# EAGLE design mk312lite_V4a (EAGLE 9.6.2)

## Sheet 1 of 5: PSU
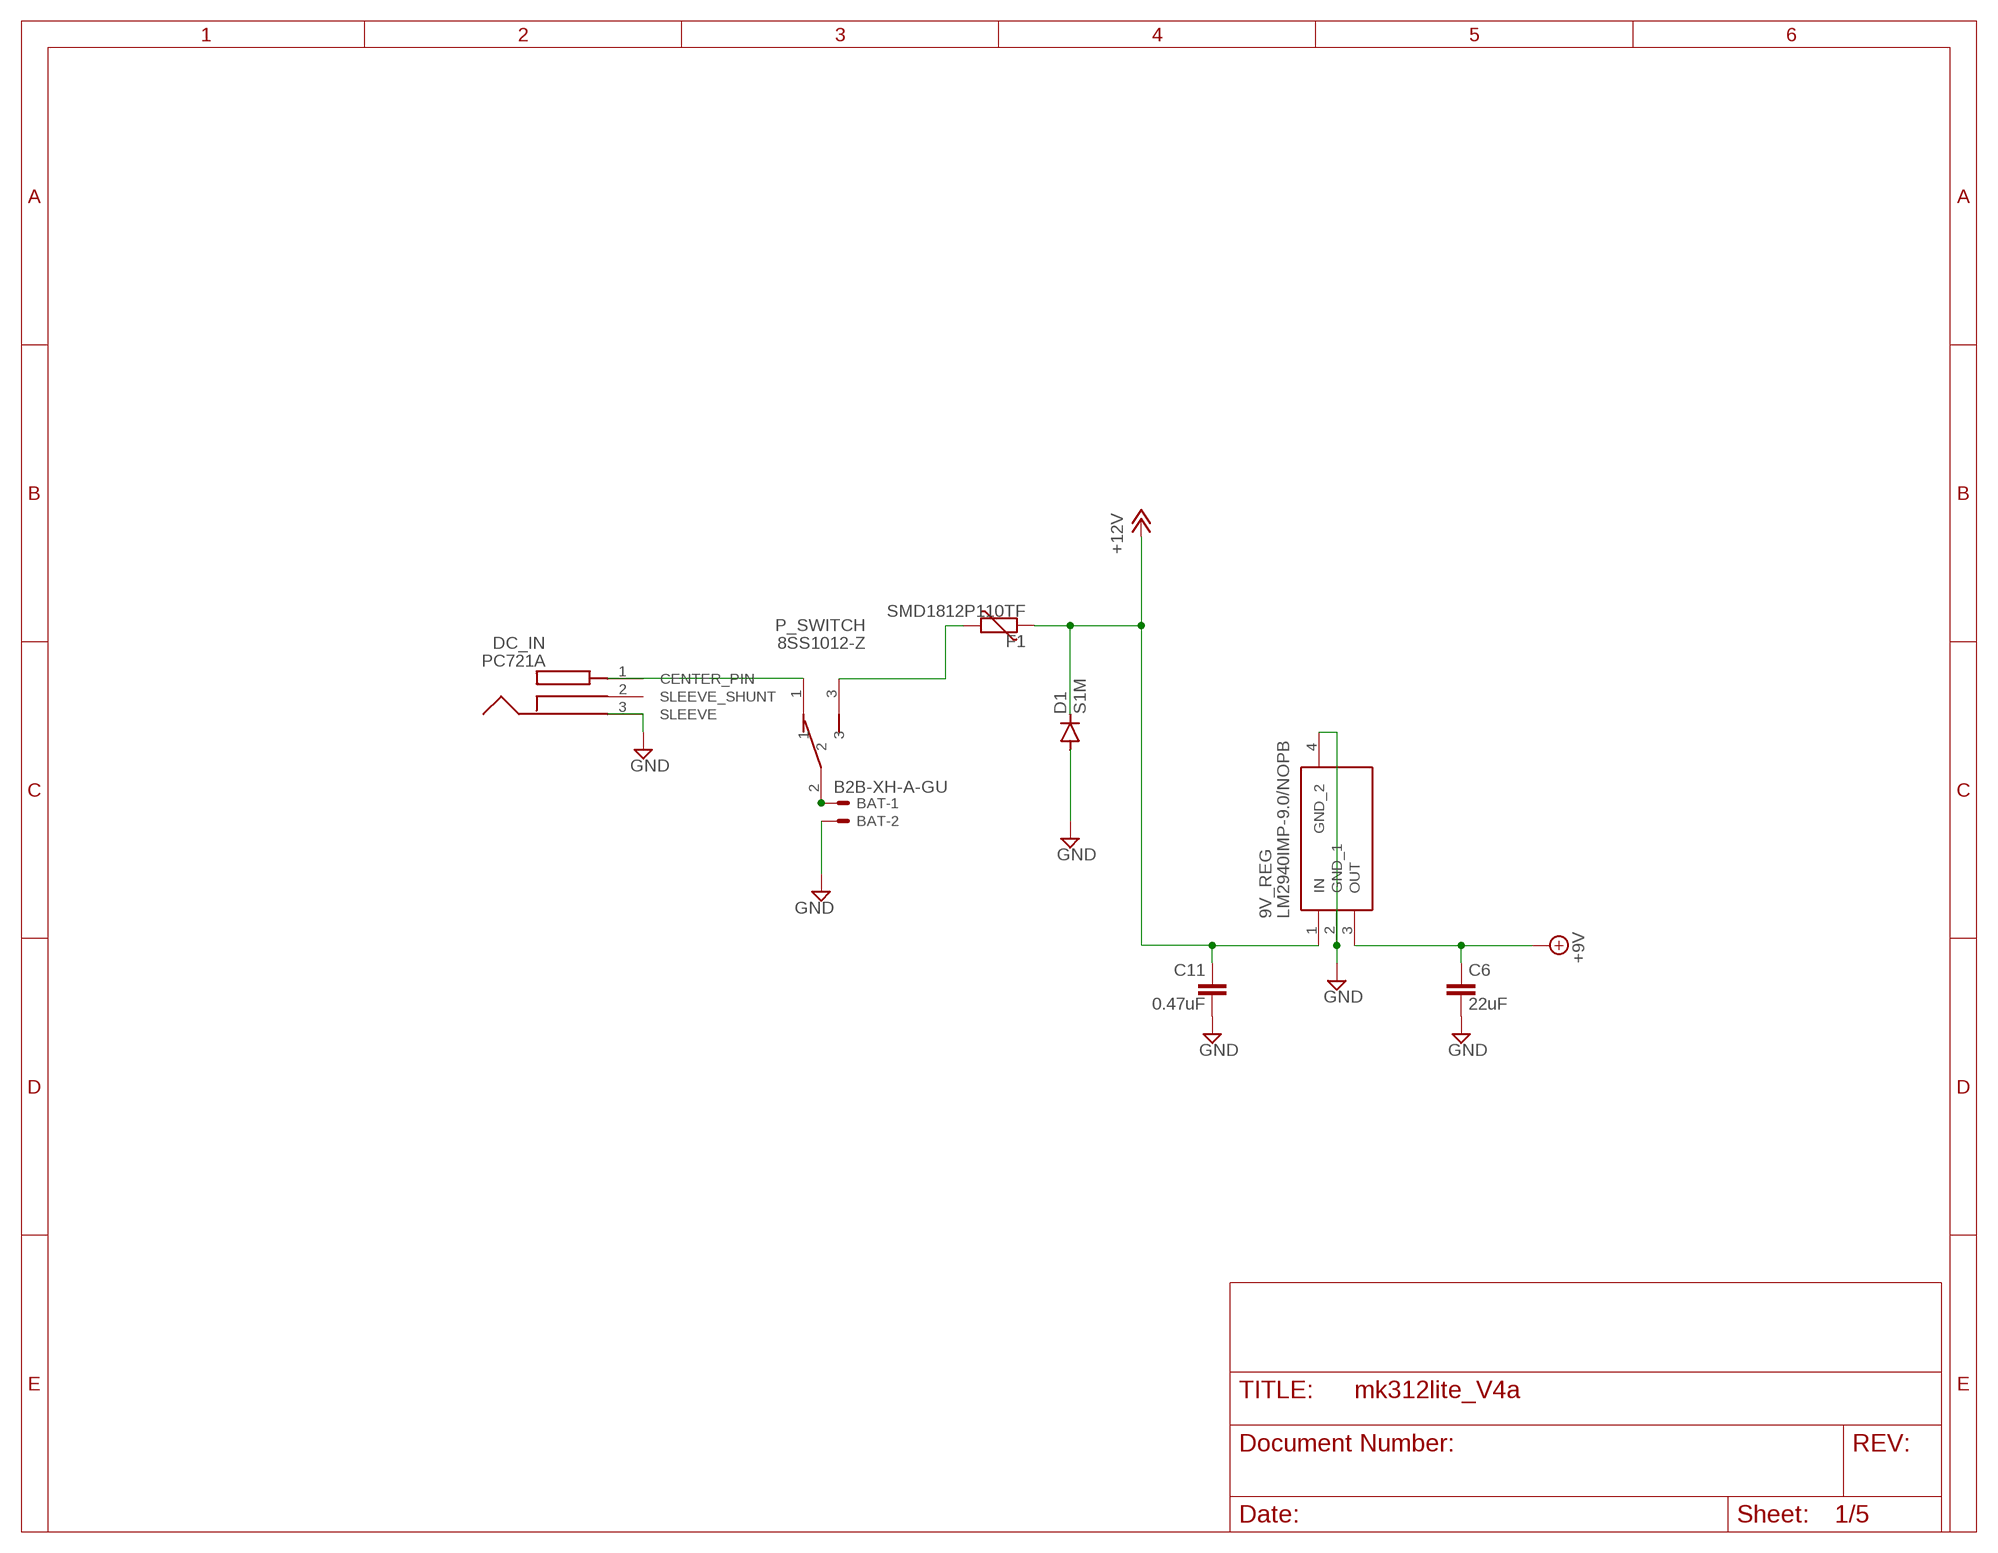
[diagram p0: schematic, sheet 1]

### Parts
9V_REG  LM2940IMP-9.0/NOPB  LM2940IMP-9.0_NOPB  [SOT230P700X180-4N]
BAT  B2B-XH-A-GU  JST-XH-02-PIN-LONG-PAD  [JST-XH-02-PACKAGE-LONG-PAD]
C6  22uF  C-EUC1206  [C1206]
C11  0.47uF  C-EUC0805  [C0805]
D1  S1M  [SMA]
DC_IN  PC721A  [PC721A]
F1  SMD1812P110TF  VARISTORCN1812  [CT/CN1812]
P_SWITCH  8SS1012-Z  [8SS1012Z]

### Nets
+9V [pwr]: 9V_REG.3(OUT) C6.1 ; also sheet 4
+12V [pwr]: 9V_REG.1(IN) C11.1 D1.C F1.2 ; also sheet 2,5
GND [pwr]: 9V_REG.2(GND_1) 9V_REG.4(GND_2) BAT.2 C6.2 C11.2 D1.A DC_IN.3(SLEEVE) ; also sheet 2,3,4,5
N$9: BAT.1 P_SWITCH.2
N$10: F1.1 P_SWITCH.3
N$14: DC_IN.1(CENTER_PIN) P_SWITCH.1
Unconnected: DC_IN.2(SLEEVE_SHUNT)

## Sheet 2 of 5
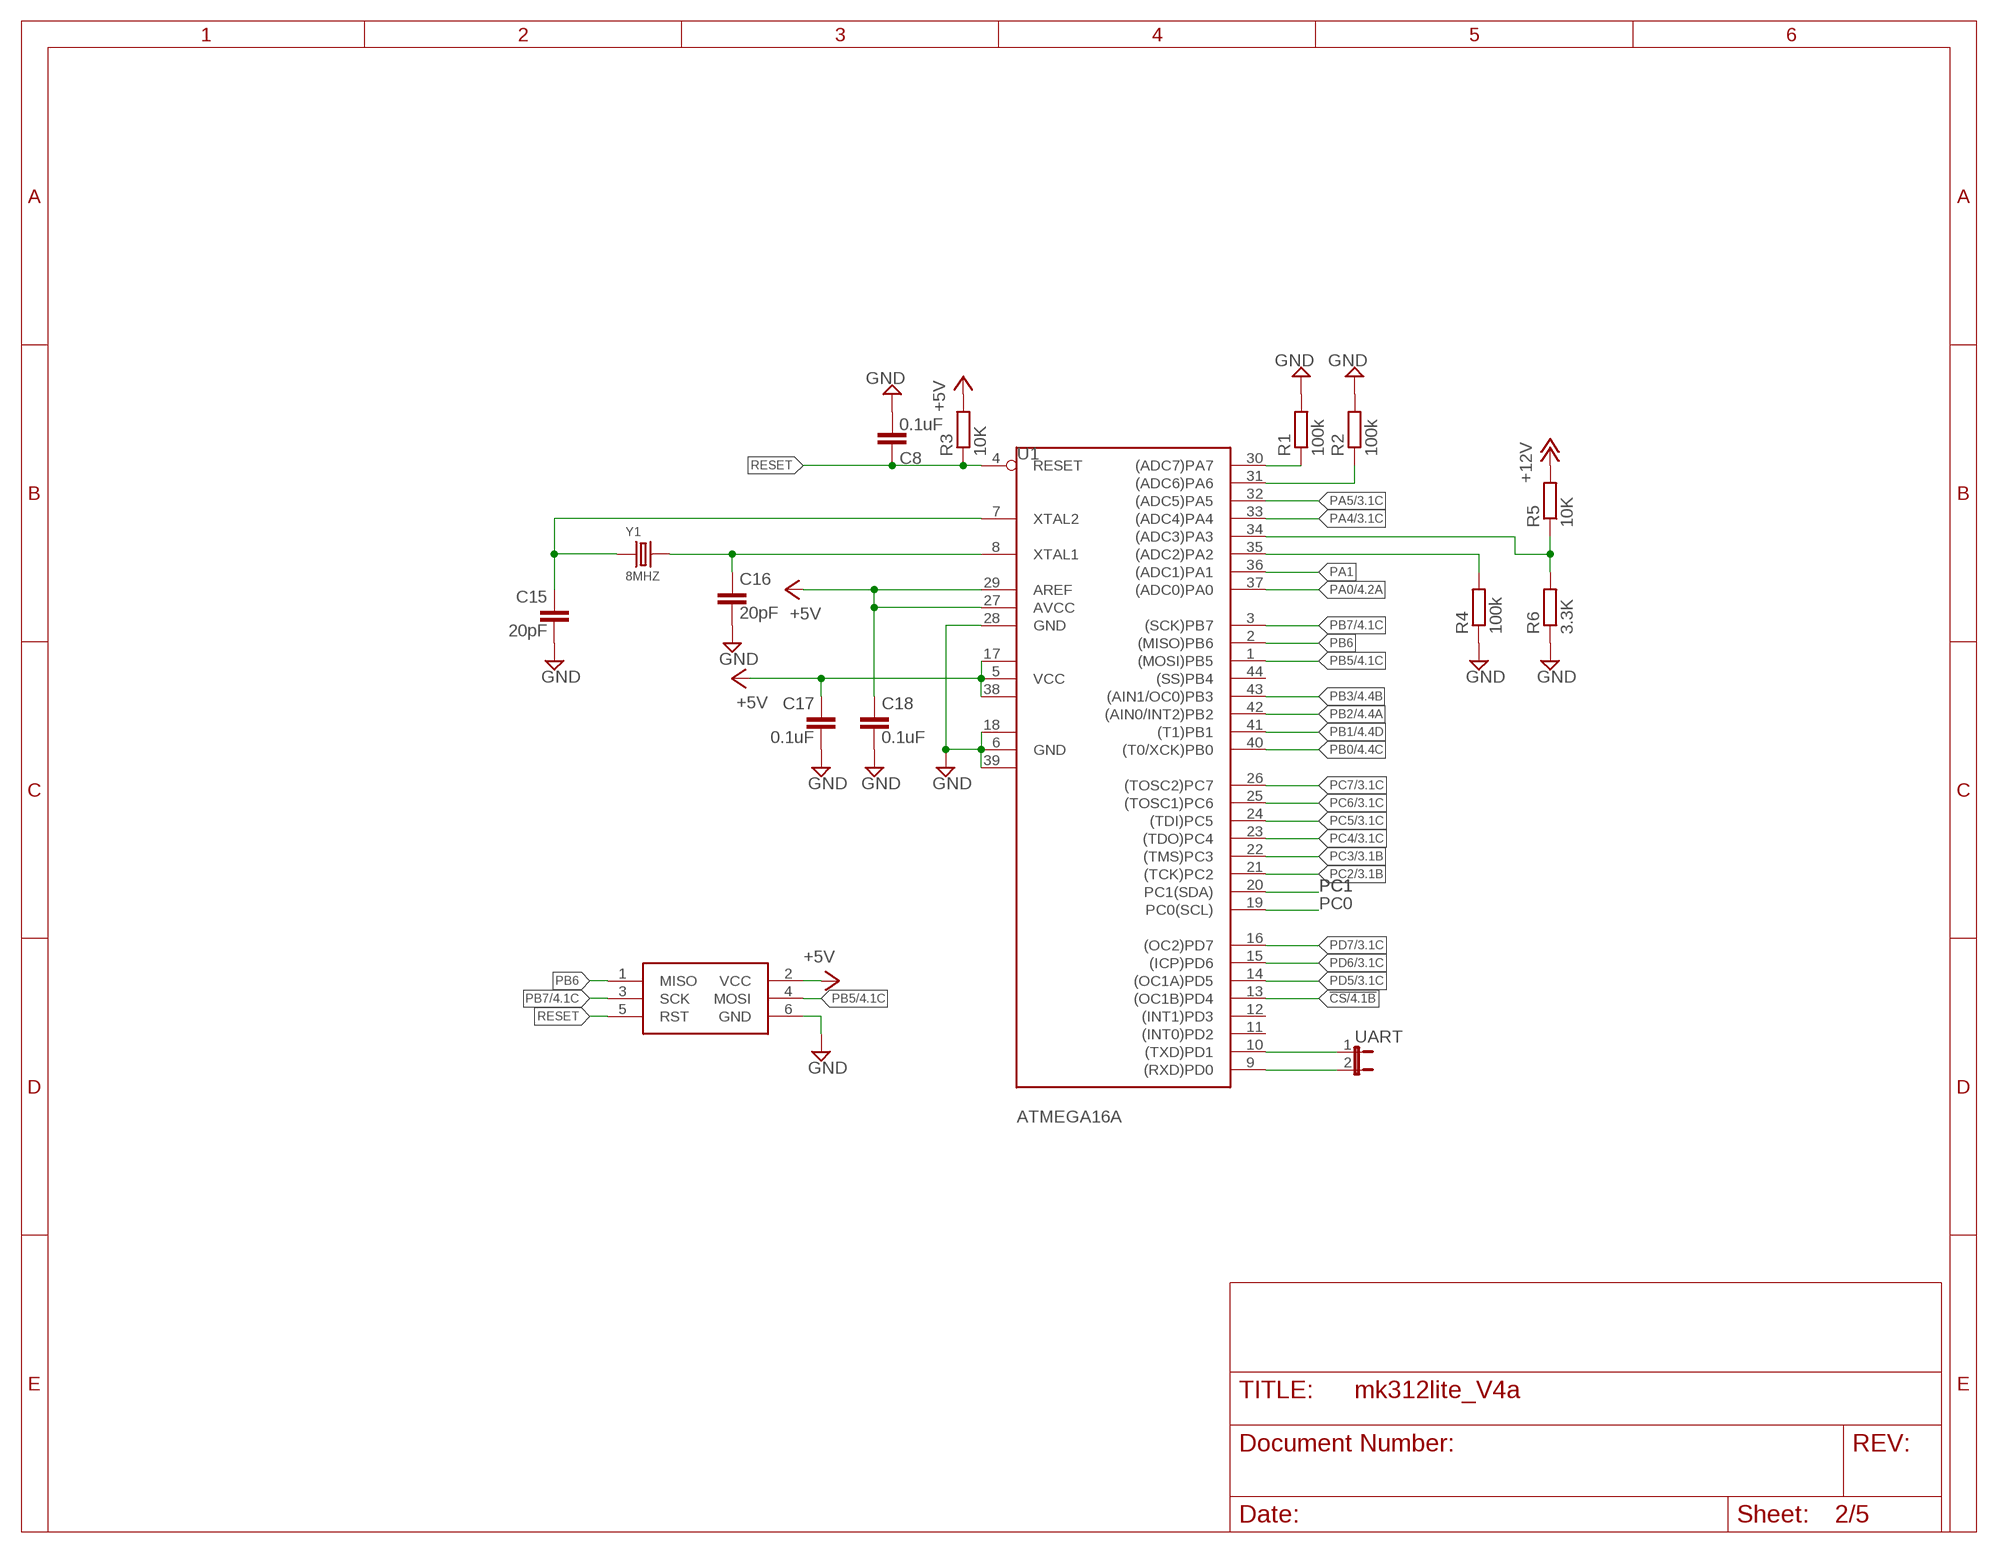
[diagram p1: schematic, sheet 2]

### Parts
C8  0.1uF  C-EUC0805  [C0805]
C15  20pF  C-EUC0603  [C0603]
C16  20pF  C-EUC0603  [C0603]
C17  0.1uF  C-EUC0805  [C0805]
C18  0.1uF  C-EUC0805  [C0805]
ISP1  AVRISP-6  [AVRISP]
R1  100k  R-EU_R0805  [R0805]
R2  100k  R-EU_R0805  [R0805]
R3  10K  R-EU_R0805  [R0805]
R4  100k  R-EU_R0805  [R0805]
R5  10K  R-EU_R0805  [R0805]
R6  3.3K  R-EU_R0805  [R0805]
U1  ATMEGA16A  MEGA16-A  [TQFP44]
UART  JP1E  [JP1]
Y1  8MHZ  SMD-CRYSTAL-8MHZ-20PF-20PPM(2P-5.0X3.2MM)  [X2-SMD-5.0X3.2X1.3MM]

### Nets
!CS: U1.13((OC1B)PD4) ; also sheet 4
+5V [pwr]: C17.1 C18.1 ISP1.2(VCC) R3.2 U1.5(VCC) U1.17(VCC1) U1.27(AVCC) U1.29(AREF) U1.38(VCC2) ; also sheet 3,4,5
+12V [pwr]: R5.2 ; also sheet 1,5
GND [pwr]: C8.2 C15.2 C16.2 C17.2 C18.2 ISP1.6(GND) R1.2 R2.2 R4.1 R6.1 U1.6(GND) U1.18(GND1) U1.28(GND) U1.39(GND2) ; also sheet 1,3,4,5
N$2: R5.1 R6.2 U1.34((ADC3)PA3)
N$3: R4.2 U1.35((ADC2)PA2)
N$16: R1.1 U1.30((ADC7)PA7)
N$17: C16.1 U1.8(XTAL1) Y1.2
N$20: R2.1 U1.31((ADC6)PA6)
N$26: U1.10((TXD)PD1) UART.1
N$31: U1.9((RXD)PD0) UART.2
N$32: C15.1 U1.7(XTAL2) Y1.1
PA0: U1.37((ADC0)PA0) ; also sheet 4
PA1: U1.36((ADC1)PA1) ; also sheet 3
PA4: U1.33((ADC4)PA4) ; also sheet 3
PA5: U1.32((ADC5)PA5) ; also sheet 3
PB0: U1.40((T0/XCK)PB0) ; also sheet 4
PB1: U1.41((T1)PB1) ; also sheet 4
PB2: U1.42((AIN0/INT2)PB2) ; also sheet 4
PB3: U1.43((AIN1/OC0)PB3) ; also sheet 4
PB5: ISP1.4(MOSI) U1.1((MOSI)PB5) ; also sheet 4
PB6: ISP1.1(MISO) U1.2((MISO)PB6)
PB7: ISP1.3(SCK) U1.3((SCK)PB7) ; also sheet 4
PC0: U1.19(PC0(SCL)) ; also sheet 3
PC1: U1.20(PC1(SDA)) ; also sheet 3
PC2: U1.21((TCK)PC2) ; also sheet 3
PC3: U1.22((TMS)PC3) ; also sheet 3
PC4: U1.23((TDO)PC4) ; also sheet 3
PC5: U1.24((TDI)PC5) ; also sheet 3
PC6: U1.25((TOSC1)PC6) ; also sheet 3
PC7: U1.26((TOSC2)PC7) ; also sheet 3
PD5: U1.14((OC1A)PD5) ; also sheet 3
PD6: U1.15((ICP)PD6) ; also sheet 3
PD7: U1.16((OC2)PD7) ; also sheet 3
RESET: C8.1 ISP1.5(RST) R3.1 U1.4(RESET)
Unconnected: U1.11((INT0)PD2) U1.12((INT1)PD3) U1.44((SS)PB4)

## Sheet 3 of 5: Small PCB
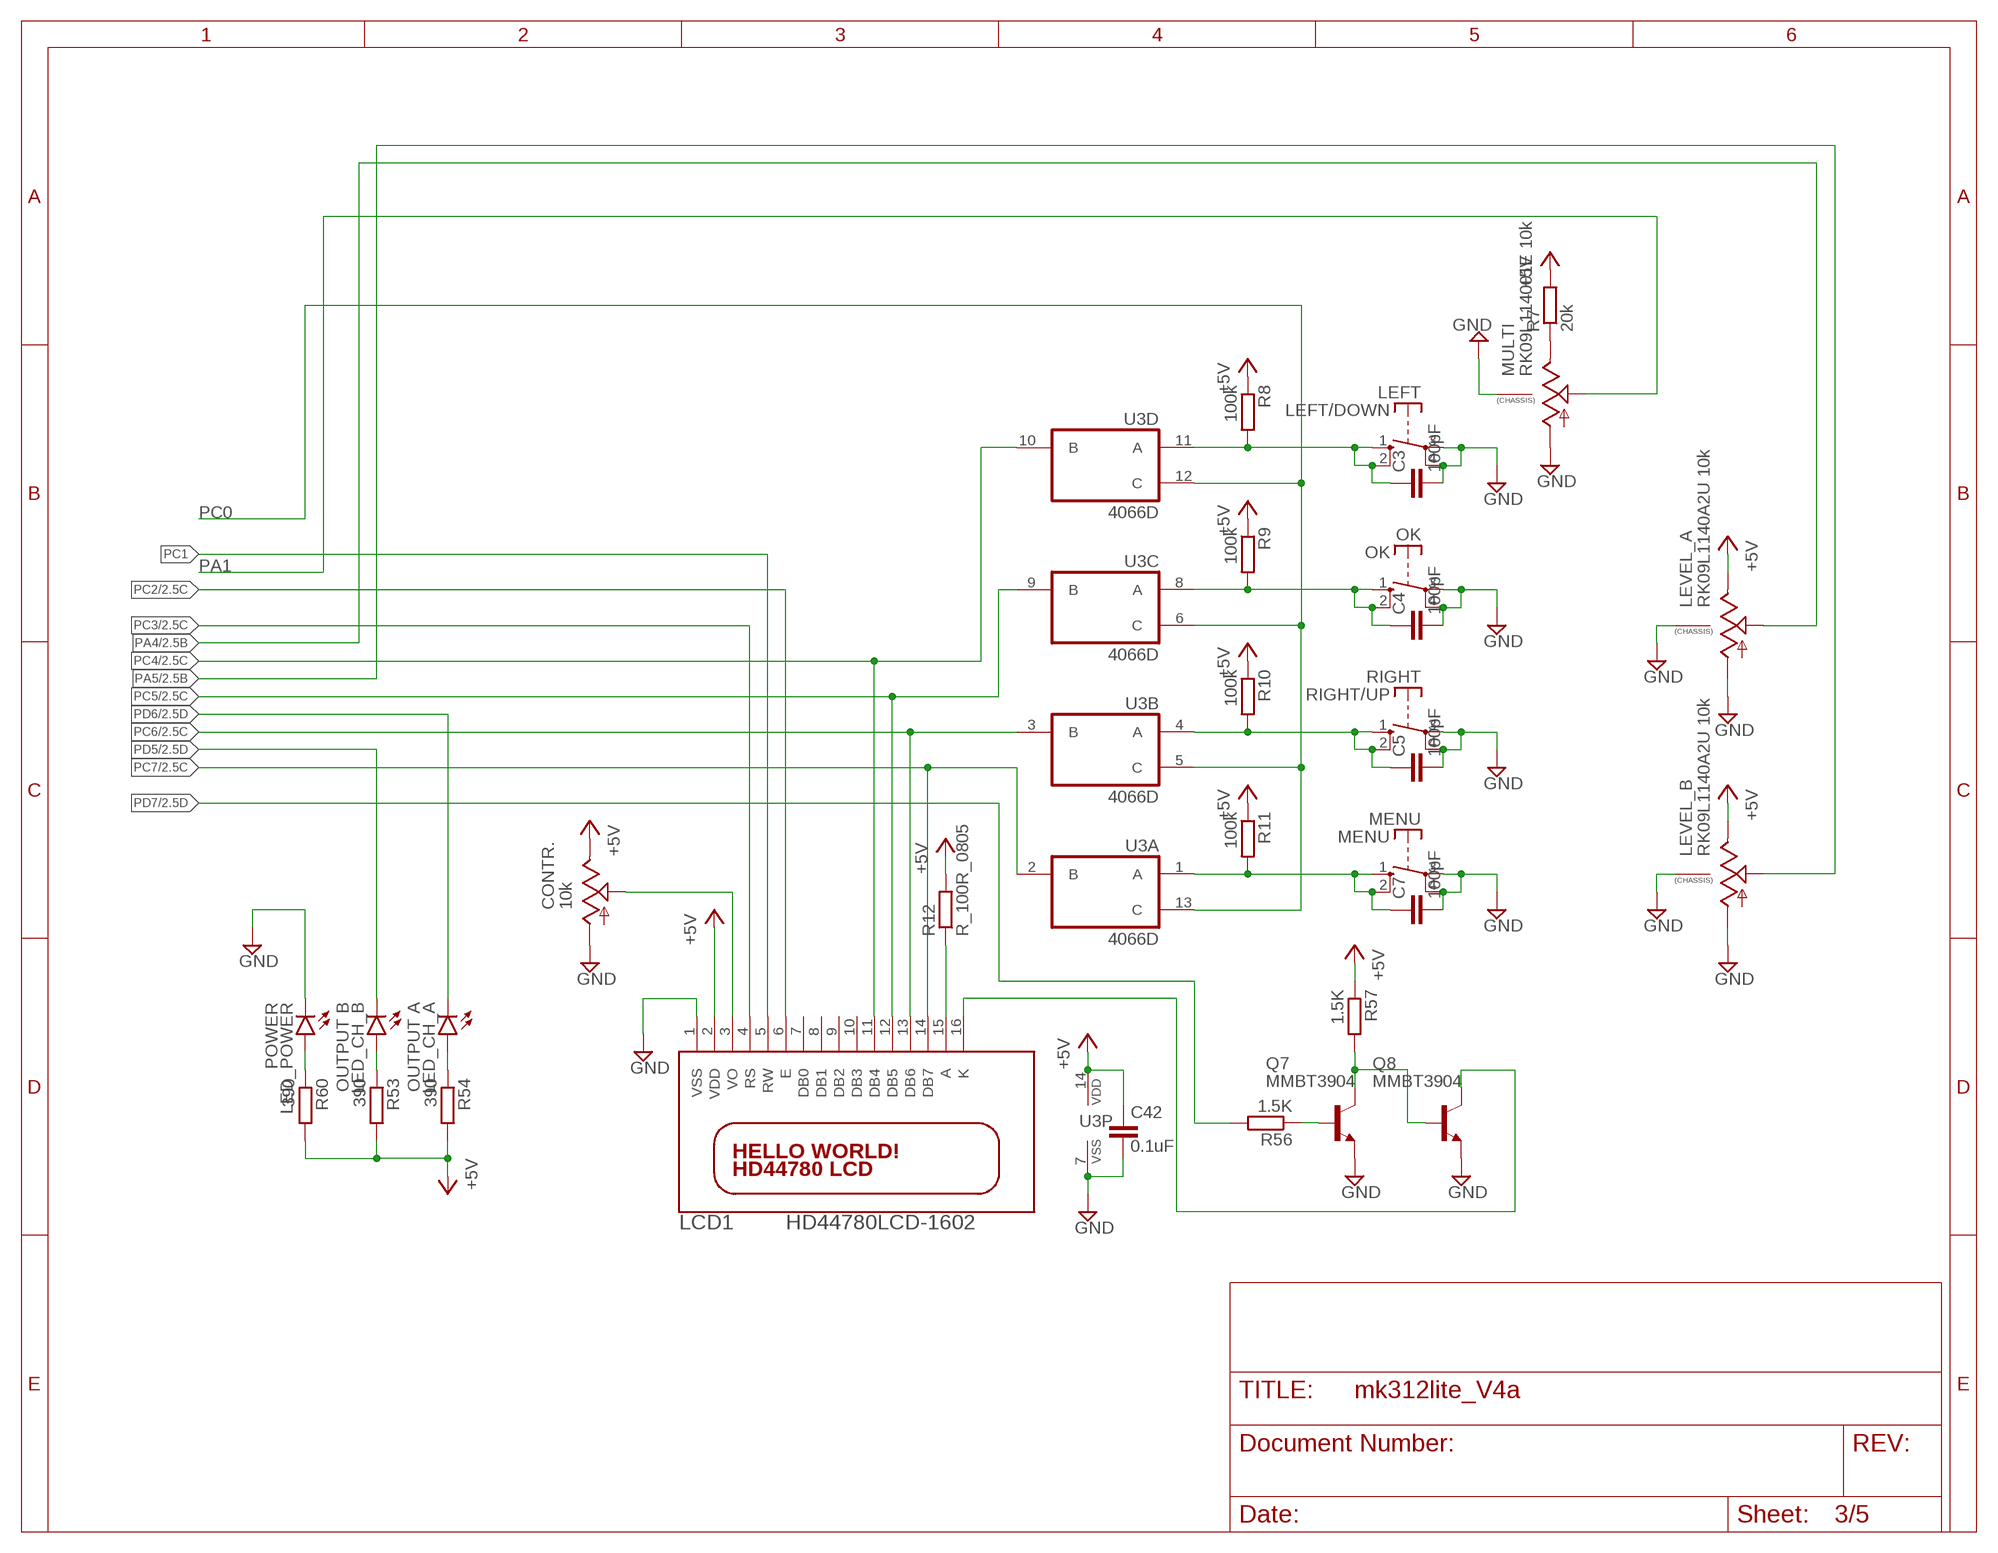
[diagram p2: schematic, sheet 3]

### Parts
C3  100pF  C-EUC0805  [C0805]
C4  100pF  C-EUC0805  [C0805]
C5  100pF  C-EUC0805  [C0805]
C7  100pF  C-EUC0805  [C0805]
C42  0.1uF  C-EUC0805  [C0805]
CONTR.  10k  TRIM_US-B25P  [B25P]
LCD1  HD44780LCD-1602  [LCD1602]
LED_CH_A  OUTPUT A  LED3MM  [LED3MM]
LED_CH_B  OUTPUT B  LED3MM  [LED3MM]
LED_POWER  POWER  LED3MM  [LED3MM]
LEFT  LEFT/DOWN  DTE6K  [DTE6K]
LEVEL_A  RK09L1140A2U 10k  9MM_SNAP-IN_POT_CHASSIS  [9MM_SNAP-IN_POT]
LEVEL_B  RK09L1140A2U 10k  9MM_SNAP-IN_POT_CHASSIS  [9MM_SNAP-IN_POT]
MENU  MENU  DTE6K  [DTE6K]
MULTI  RK09L114001E 10k  9MM_SNAP-IN_POT_CHASSIS  [9MM_SNAP-IN_POT]
OK  OK  DTE6K  [DTE6K]
Q7  MMBT3904  MMBT3904LT1-NPN-SOT23-BEC  [SOT23-BEC]
Q8  MMBT3904  MMBT3904LT1-NPN-SOT23-BEC  [SOT23-BEC]
R7  20k  R-EU_R0805  [R0805]
R8  100k  R-EU_R0805  [R0805]
R9  100k  R-EU_R0805  [R0805]
R10  100k  R-EU_R0805  [R0805]
R11  100k  R-EU_R0805  [R0805]
R12  R_100R_0805  [R0805]
R53  390  R-EU_R0805  [R0805]
R54  390  R-EU_R0805  [R0805]
R56  1.5K  R-EU_R0805  [R0805]
R57  1.5K  R-EU_R0805  [R0805]
R60  390  R-EU_R0805  [R0805]
RIGHT  RIGHT/UP  DTE6K  [DTE6K]
U3  4066D  [SO14]

### Nets
+5V [pwr]: C42.1 CONTR..E LCD1.2(VDD) LEVEL_A.3(E) LEVEL_B.3(E) R7.2 R8.1 R9.1 R10.1 R11.1 R12.2 R53.2 R54.2 R57.1 R60.2 U3.14(P:VDD) ; also sheet 2,4,5
GND [pwr]: C3.2 C4.2 C5.2 C7.2 C42.2 CONTR..A LCD1.1(VSS) LED_POWER.K(C) LEFT.3(P) LEFT.4(P) LEVEL_A.1(A) LEVEL_A.CHASSIS2 LEVEL_B.1(A) LEVEL_B.CHASSIS2 MENU.3(P) MENU.4(P) MULTI.1(A) MULTI.CHASSIS2 OK.3(P) OK.4(P) Q7.E Q8.E RIGHT.3(P) RIGHT.4(P) U3.7(P:VSS) ; also sheet 1,2,4,5
N$1: MULTI.3(E) R7.1
N$4: C4.1 OK.1(S) OK.2(S) R9.2 U3.8(C:A)
N$5: C3.1 LEFT.1(S) LEFT.2(S) R8.2 U3.11(D:A)
N$7: C5.1 R10.2 RIGHT.1(S) RIGHT.2(S) U3.4(B:A)
N$23: LED_CH_B.A R53.1
N$29: LED_CH_A.A R54.1
N$30: CONTR..S LCD1.3(VO)
N$47: LCD1.15(A) R12.1
N$80: C7.1 MENU.1(S) MENU.2(S) R11.2 U3.1(A:A)
N$81: LED_POWER.A R60.1
N$82: Q7.B R56.1
N$83: Q7.C Q8.B R57.2
N$84: LCD1.16(K) Q8.C
PA1: MULTI.2(S) ; also sheet 2
PA4: LEVEL_A.2(S) ; also sheet 2
PA5: LEVEL_B.2(S) ; also sheet 2
PC0: U3.5(B:C) U3.6(C:C) U3.12(D:C) U3.13(A:C) ; also sheet 2
PC1: LCD1.5(RW) ; also sheet 2
PC2: LCD1.6(E) ; also sheet 2
PC3: LCD1.4(RS) ; also sheet 2
PC4: LCD1.11(DB4) U3.10(D:B) ; also sheet 2
PC5: LCD1.12(DB5) U3.9(C:B) ; also sheet 2
PC6: LCD1.13(DB6) U3.3(B:B) ; also sheet 2
PC7: LCD1.14(DB7) U3.2(A:B) ; also sheet 2
PD5: LED_CH_B.K(C) ; also sheet 2
PD6: LED_CH_A.K(C) ; also sheet 2
PD7: R56.2 ; also sheet 2
Unconnected: LCD1.7(DB0) LCD1.8(DB1) LCD1.9(DB2) LCD1.10(DB3)

## Sheet 4 of 5: Output stage
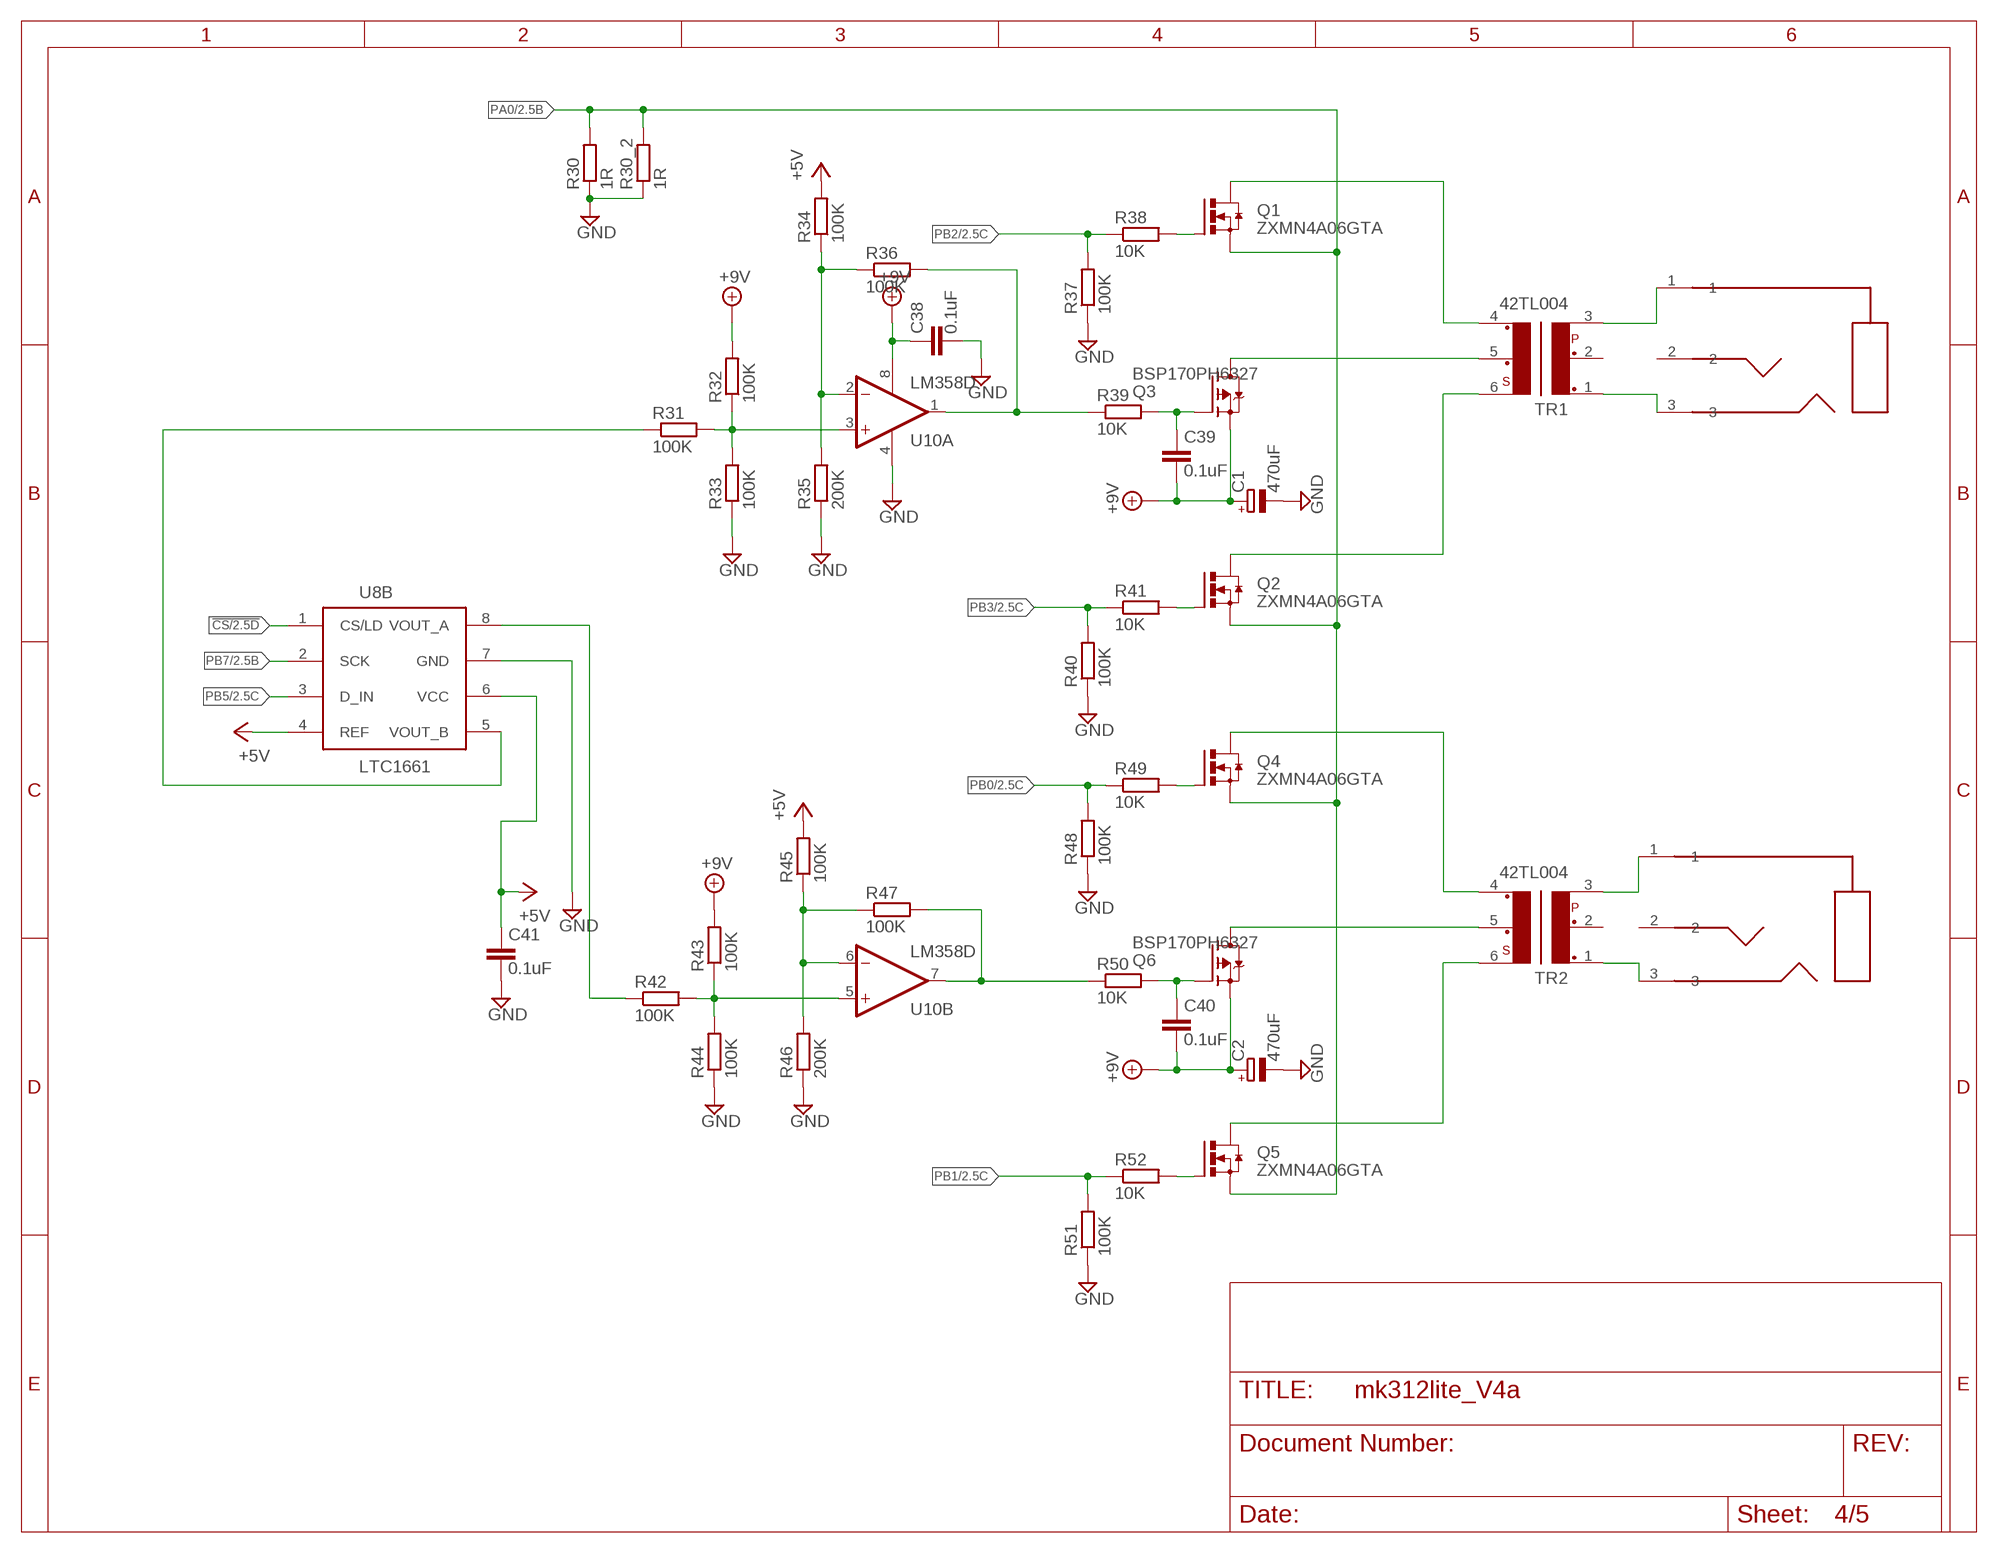
[diagram p3: schematic, sheet 4]

### Parts
C1  470uF  CPOL-EU150CLZ-1010  [150CLZ-1010]
C2  470uF  CPOL-EU150CLZ-1010  [150CLZ-1010]
C38  0.1uF  C-EUC0805  [C0805]
C39  0.1uF  C-EUC0805  [C0805]
C40  0.1uF  C-EUC0805  [C0805]
C41  0.1uF  C-EUC0805  [C0805]
CHAN_A  PJ-301C  PC-301C  [PJ-301C]
CHAN_B  PJ-301C  PC-301C  [PJ-301C]
Q1  ZXMN4A06GTA  N-HEXFET-2D_SOT232-IRLL2705  [SOT223]
Q2  ZXMN4A06GTA  N-HEXFET-2D_SOT232-IRLL2705  [SOT223]
Q3  BSP170PH6327  IRFL9014TRPBF  [SOT230P700X180-4N]
Q4  ZXMN4A06GTA  N-HEXFET-2D_SOT232-IRLL2705  [SOT223]
Q5  ZXMN4A06GTA  N-HEXFET-2D_SOT232-IRLL2705  [SOT223]
Q6  BSP170PH6327  IRFL9014TRPBF  [SOT230P700X180-4N]
R30  1R  R-EU_R1206  [R1206]
R30_2  1R  R-EU_R1206  [R1206]
R31  100K  R-EU_R0805  [R0805]
R32  100K  R-EU_R0805  [R0805]
R33  100K  R-EU_R0805  [R0805]
R34  100K  R-EU_R0805  [R0805]
R35  200K  R-EU_R0805  [R0805]
R36  100K  R-EU_R0805  [R0805]
R37  100K  R-EU_R0805  [R0805]
R38  10K  R-EU_R0805  [R0805]
R39  10K  R-EU_R0805  [R0805]
R40  100K  R-EU_R0805  [R0805]
R41  10K  R-EU_R0805  [R0805]
R42  100K  R-EU_R0805  [R0805]
R43  100K  R-EU_R0805  [R0805]
R44  100K  R-EU_R0805  [R0805]
R45  100K  R-EU_R0805  [R0805]
R46  200K  R-EU_R0805  [R0805]
R47  100K  R-EU_R0805  [R0805]
R48  100K  R-EU_R0805  [R0805]
R49  10K  R-EU_R0805  [R0805]
R50  10K  R-EU_R0805  [R0805]
R51  100K  R-EU_R0805  [R0805]
R52  10K  R-EU_R0805  [R0805]
TR1  42TL004  42TL023  [42TL]
TR2  42TL004  42TL023  [42TL]
U8B  LTC1661  LTC1661IMS8  [MSOP8]
U10  LM358D  [SO08]

### Nets
!CS: U8B.1(CS/LD) ; also sheet 2
+5V [pwr]: C41.1 R34.2 R45.2 U8B.4(REF) U8B.6(VCC) ; also sheet 2,3,5
+9V [pwr]: C1.+ C2.+ C38.1 C39.2 C40.2 Q3.3(S) Q6.3(S) R32.2 R43.2 U10.8(P:V+) ; also sheet 1
GND [pwr]: C1.- C2.- C38.2 C41.2 R30.1 R30_2.1 R33.1 R35.1 R37.1 R40.1 R44.1 R46.1 R48.1 R51.1 U8B.7(GND) U10.4(P:V-) ; also sheet 1,2,3,5
N$6: Q3.2(D) Q3.4(D) TR1.5
N$8: Q6.2(D) Q6.4(D) TR2.5
N$11: CHAN_A.1 TR1.3
N$12: CHAN_A.3 TR1.1
N$13: CHAN_B.1 TR2.3
N$15: CHAN_B.3 TR2.1
N$18: Q1.1(G) R38.2
N$19: Q2.1(G) R41.2
N$21: C39.1 Q3.1(G) R39.2
N$22: R31.2 R32.1 R33.2 U10.3(A:+IN)
N$24: Q4.1(G) R49.2
N$25: Q5.1(G) R52.2
N$27: C40.1 Q6.1(G) R50.2
N$28: R42.2 R43.1 R44.2 U10.5(B:+IN)
N$34: Q1.2(D) Q1.4(D) TR1.4
N$36: Q4.2(D) Q4.4(D) TR2.4
N$38: Q5.2(D) Q5.4(D) TR2.6
N$39: Q2.2(D) Q2.4(D) TR1.6
N$40: R34.1 R35.2 R36.1 U10.2(A:-IN)
N$41: R45.1 R46.2 R47.1 U10.6(B:-IN)
N$42: R31.1 U8B.5(VOUT_B)
N$85: R42.1 U8B.8(VOUT_A)
PA0: Q1.3(S) Q2.3(S) Q4.3(S) Q5.3(S) R30.2 R30_2.2 ; also sheet 2
PB0: R48.2 R49.1 ; also sheet 2
PB1: R51.2 R52.1 ; also sheet 2
PB2: R37.2 R38.1 ; also sheet 2
PB3: R40.2 R41.1 ; also sheet 2
PB5: U8B.3(D_IN) ; also sheet 2
PB7: U8B.2(SCK) ; also sheet 2
PFET_A: R36.2 R39.1 U10.1(A:OUT)
PFET_B: R47.2 R50.1 U10.7(B:OUT)
Unconnected: CHAN_A.2 CHAN_B.2 TR1.2 TR2.2

## Sheet 5 of 5
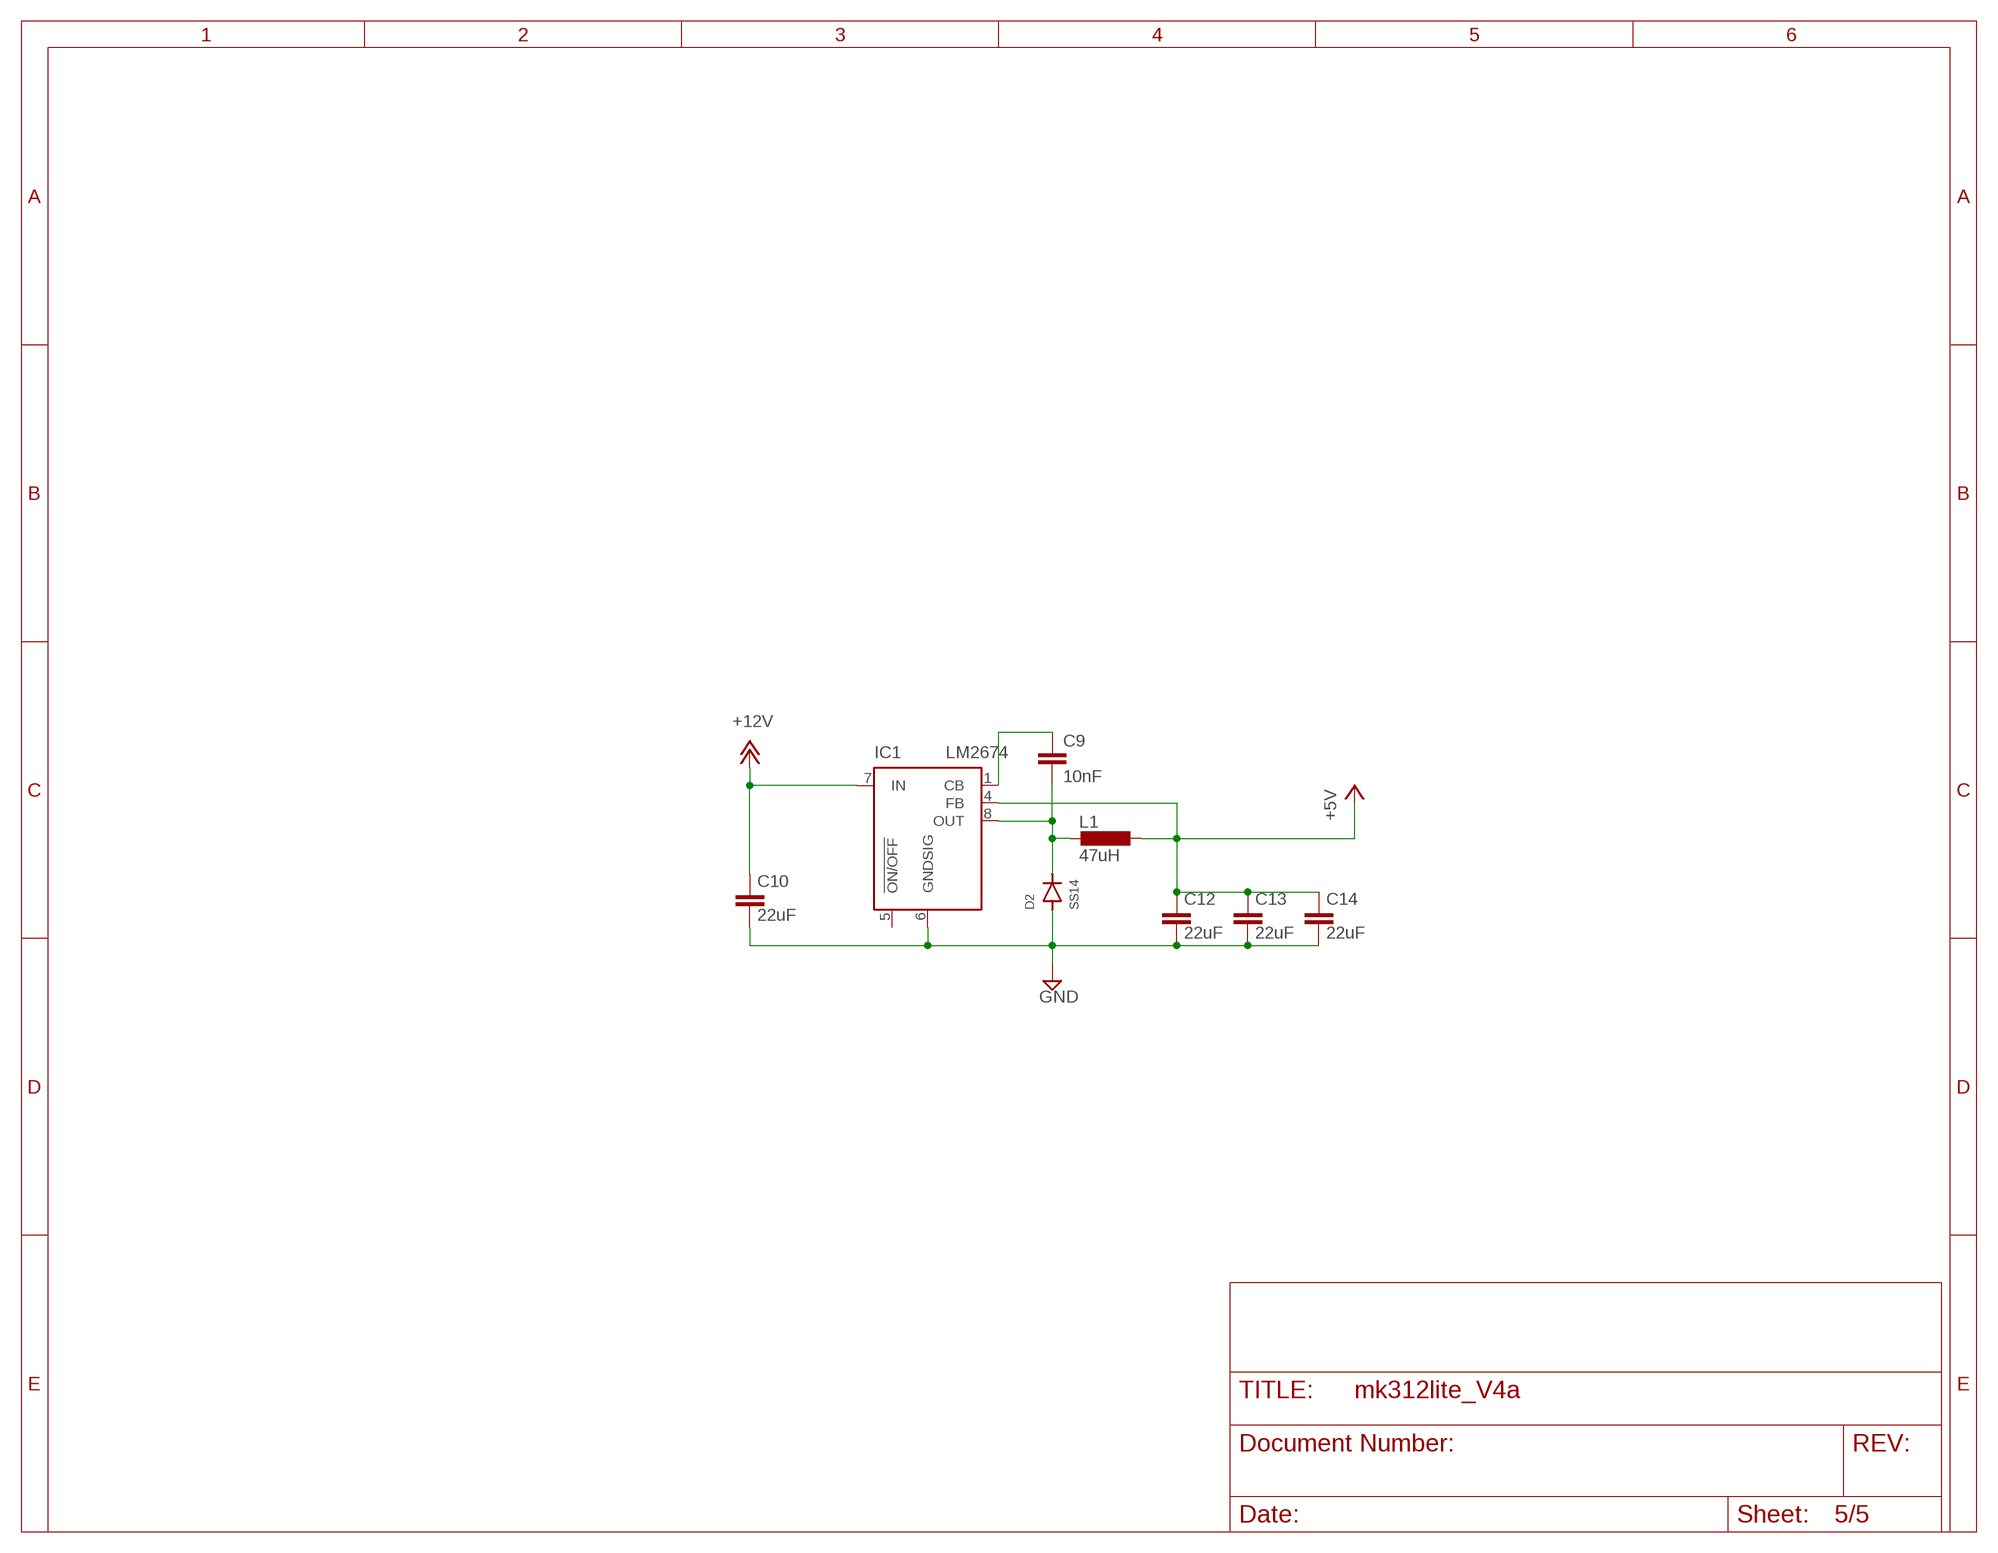
[diagram p4: schematic, sheet 5]

### Parts
C9  10nF  C-EUC0805  [C0805]
C10  22uF  C-EUC1206  [C1206]
C12  22uF  C-EUC1206  [C1206]
C13  22uF  C-EUC1206  [C1206]
C14  22uF  C-EUC1206  [C1206]
D2  SS14  S1M  [SMA]
IC1  LM2674  [SO08]
L1  47uH  SMNR4030-151MT  [SMNR4030-151MT]

### Nets
+5V [pwr]: C12.1 C13.1 C14.1 IC1.4(FB) L1.2 ; also sheet 2,3,4
+12V [pwr]: C10.1 IC1.7(IN) ; also sheet 1,2
GND [pwr]: C10.2 C12.2 C13.2 C14.2 D2.A IC1.6(GNDSIG) ; also sheet 1,2,3,4
N$33: C9.1 IC1.1(CB)
N$35: C9.2 D2.C IC1.8(OUT) L1.1
Unconnected: IC1.5(!ON/OFF)

## Library data of the parts
9V_REG = SamacSys_Parts:LM2940IMP-9.0_NOPB: LDO Voltage Regulators 1A LDO Reg Source: Datasheet <https://www.ti.com/lit/gpn/LM2940-N>; DESCRIPTION: LDO Voltage Regulators 1A LDO Reg; HEIGHT: 1.8mm; MANUFACTURER_NAME: Texas Instruments; MANUFACTURER_PART_NUMBER: LM2940IMP-9.0/NOPB; MOUSER_PART_NUMBER: 926-LM2940IMP90NOPB; MOUSER_PRICE-STOCK: https://www.mouser.co.uk/ProductDetail/Texas-Instruments/LM2940IMP-90-NOPB?qs=X1J7HmVL2ZFSe6ClMcvP2A%3D%3D
BAT = Rembrandt Electronics - JST XH Connectors v1-0:JST-XH-02-PIN: JST XH Connector 2 Pin Wire to board connector. Pitch: 2,54 mm, (0.100") Number of pins: 2 Created by Rembrandt Electronics www.rembrandtelectronics.com
C1 C2 = rcl:CPOL-EU: POLARIZED CAPACITOR, European symbol; SPICEPREFIX: C
C3-C18 C38-C42 = rcl:C-EU: CAPACITOR, European symbol; SPICEPREFIX: C
CHAN_A CHAN_B = MK312parts:PC-301C
CONTR. = pot:TRIM_US-: POTENTIOMETER
D1 D2 = diode:S1M
DC_IN = SamacSys_Parts:PC721A: Conn DC Power RCP 2 POS Solder ST Thru-Hole 3 Terminal 1 Port Source: Datasheet; DESCRIPTION: Conn DC Power RCP 2 POS Solder ST Thru-Hole 3 Terminal 1 Port; HEIGHT: 13.7mm; MANUFACTURER_NAME: Switchcraft; MANUFACTURER_PART_NUMBER: PC721A; MOUSER_PART_NUMBER: 502-PC721A; MOUSER_PRICE-STOCK: https://www.mouser.co.uk/ProductDetail/Switchcraft/PC721A?qs=fAHHVMwC%252BbgD1XRuKMSqcA%3D%3D
F1 = varistor:VARISTOR: VARISTOR
IC1 = Eagle-JeeLabs:LM2674: 0.5A Step-Down Voltage Regulator
ISP1 = adafruit:AVRISP: AVR ISP HEADER Standard 6 pin header for AVR programming
L1 = MK312parts:SMNR4030-151MT: Shielded Power Inductors Package 6.6 × 6.6 mm x 4.1 mm high Source: http://www.farnell.com/datasheets/1681958.pdf
LCD1 = MK312parts:HD44780LCD: HD44780 LCD Standard character type LCDs, available in sizes from 8x1 to 40x4!
LED_CH_A LED_CH_B LED_POWER = led:LED: LED OSRAM: - CHIPLED LG R971, LG N971, LY N971, LG Q971, LY Q971, LO R971, LY R971 LH N974, LH R974 LS Q976, LO Q976, LY Q976 LO Q996 - Hyper CHIPLED LW Q18S LB Q993, LB Q99A, LB R99A - SideLED LS A670, LO A670, LY A670, LG A670, LP A670 LB A673, LV A673, LT A673, LW A673 LH A674 LY A675 LS A676, LA A676, LO A676, LY A676, LW A676 LS A679, LY A679, LG A679 - Hyper Micro SIDELED® LS Y876, LA Y876, LO Y876, LY Y876 LT Y87S - SmartLED LW L88C, LW L88S LB L89C, LB L89S, LG L890 LS L89K, LO L89K, LY L89K LS L896, LA L896, LO L896, LY L896 - TOPLED LS T670, LO T670, LY T670, LG T670, LP T670 LSG T670, LSP T670, LSY T670, LOP T670, LYG T670 LG T671, LOG T671, LSG T671 LB T673, LV T673, LT T673, LW T673 LH T674 LS T676, LA T676, LO T676, LY T676, LB T676, LH T676, LSB T676, LW T676 LB T67C, LV T67C, LT T67C, LS T67K, LO T67K, LY T67K, LW E67C LS E67B, LA E67B, LO E67B, LY E67B, LB E67C, LV E67C, LT E67C LW T67C LS T679, LY T679, LG T679 LS T770, LO T770, LY T770, LG T770, LP T770 LB T773, LV T773, LT T773, LW T773 LH T774 LS E675, LA E675, LY E675, LS T675 LS T776, LA T776, LO T776, LY T776, LB T776 LHGB T686 LT T68C, LB T68C - Hyper Mini TOPLED® LB M676 - Mini TOPLED Santana® LG M470 LS M47K, LO M47K, LY M47K Source: http://www.osram.convergy.de LUXEON: - LUMILED® LXK2-PW12-R00, LXK2-PW12-S00, LXK2-PW14-U00, LXK2-PW14-V00 LXK2-PM12-R00, LXK2-PM12-S00, LXK2-PM14-U00 LXK2-PE12-Q00, LXK2-PE12-R00, LXK2-PE12-S00, LXK2-PE14-T00, LXK2-PE14-U00 LXK2-PB12-K00, LXK2-PB12-L00, LXK2-PB12-M00, LXK2-PB14-N00, LXK2-PB14-P00, LXK2-PB14-Q00 LXK2-PR12-L00, LXK2-PR12-M00, LXK2-PR14-Q00, LXK2-PR14-R00 LXK2-PD12-Q00, LXK2-PD12-R00, LXK2-PD12-S00 LXK2-PH12-R00, LXK2-PH12-S00 LXK2-PL12-P00, LXK2-PL12-Q00, LXK2-PL12-R00 Source: www.luxeon.com KINGBRIGHT: KA-3528ASYC Source: www.kingbright.com
LEFT MENU OK RIGHT = switch-misc:DT: ITT SWITCH
LEVEL_A LEVEL_B MULTI = MusicThingModular:9MM_SNAP-IN_POT_CHASSIS: 9mm vertical snap-in pot, Alpha / Panasonic style, with a connection to the metal chassis for grounding
P_SWITCH = SamacSys_Parts:8SS1012-Z: NIDEC COPAL ELECTRONICS - 8SS1012-Z - SLIDE SWITCH, SPDT, 6A, 125VAC, TH Source: Datasheet <https://www.nidec-copal-electronics.com/e/catalog/switch/8ss.pdf>; DESCRIPTION: NIDEC COPAL ELECTRONICS - 8SS1012-Z - SLIDE SWITCH, SPDT, 6A, 125VAC, TH; HEIGHT: 14.75mm; MANUFACTURER_NAME: Copal Electronics; MANUFACTURER_PART_NUMBER: 8SS1012-Z
Q1 Q2 = MK312parts:N-HEXFET-2D_?-*: HEXFET® Power MOSFET 2 Drain connects http://www.irf.com/product-info/datasheets/data/irll014n.pdf; ALTERNATIVE: IRL100HS; ALTERNATIVE2: IRLL2705
Q3 Q6 = SamacSys_Parts:IRFL9014TRPBF: IRFL9014TRPBF, P-channel MOSFET Transistor 1.8 A 60 V, 4-Pin SOT-223 Source: Datasheet <http://www.vishay.com/docs/91195/sihfl901.pdf>; ALTERNATIVE: BSP170PH6327
Q4 Q5 = MK312parts:N-HEXFET-2D_?-*: HEXFET® Power MOSFET 2 Drain connects http://www.irf.com/product-info/datasheets/data/irll014n.pdf
Q7 Q8 = transistor:*-NPN-: NPN Transistror BF959 corrected 2008.03.06
R1-R11 R30 R30_2 R31-R54 R56 R57 R60 = rcl:R-EU_: RESISTOR, European symbol; SPICEPREFIX: R
R12 = JLC PCB Basic Parts_loc:R_: Resistor General purpose SMD Resistor; LCSC_DATASHEET: https://datasheet.lcsc.com/lcsc/2110251730_UNI-ROYAL-Uniroyal-Elec-0805W8F1000T5E_C17408.pdf; LCSC_PART: C17408; LCSC_ROTATION_CCW: 0; LCSC_STOCK: 1593241; PROPERTIES: ±1% 125mW Thick Film Resistors 150V ±100ppm -55°C~+155°C 100Ohm 0805 ROHS
TR1 TR2 = trafo-xicon:42T?*: Xicon Micro-Mini EI-12 Audio Transformers 42TL/42TC/42TM Series Source: http://www.mouser.com//catalog/specsheets/164201.pdf http://www.mouser.com/catalog/specsheets/114225.pdf http://www.mouser.com/catalog/specsheets/164267.pdf; OC_FARNELL: unknown; OC_NEWARK: unknown
U1 = atmel:MEGA16: MICROCONTROLLER 16 Kbytes FLASH 1 kbytes SRAM 512 bytes EEPROM USART 8-channel 10 bit ADC Source: avr.lbr; MPN: ATMEGA16-16AU; OC_FARNELL: 9171134; OC_NEWARK: 96K6515
U3 = 40xx:4066: Quad bilateral ANALOG SWITCH
U8B = MK312parts:LTC1661IMS8: LTC1661 DAC, MSOP-8 package
U10 = linear:LM358: OP AMP also LM158; LM258; LM2904 Source: http://cache.national.com/ds/LM/LM158.pdf
UART = jumper:JP1E: JUMPER
Y1 = Seeed-OPL-Crystal-Oscillator:SMD-CRYSTAL-8MHZ-20PF-20PPM(2P-5.0X3.2MM): 306010004; MPN: 5032/2P

## Net classes
0 default: width 0.254 mm, drill 0.254 mm, clearance 0.254 mm
1 signal: width 0.254 mm, drill 0.254 mm, clearance 0.254 mm
2 pwr: width 0.305 mm, drill 0.254 mm, clearance 0.254 mm

## Board
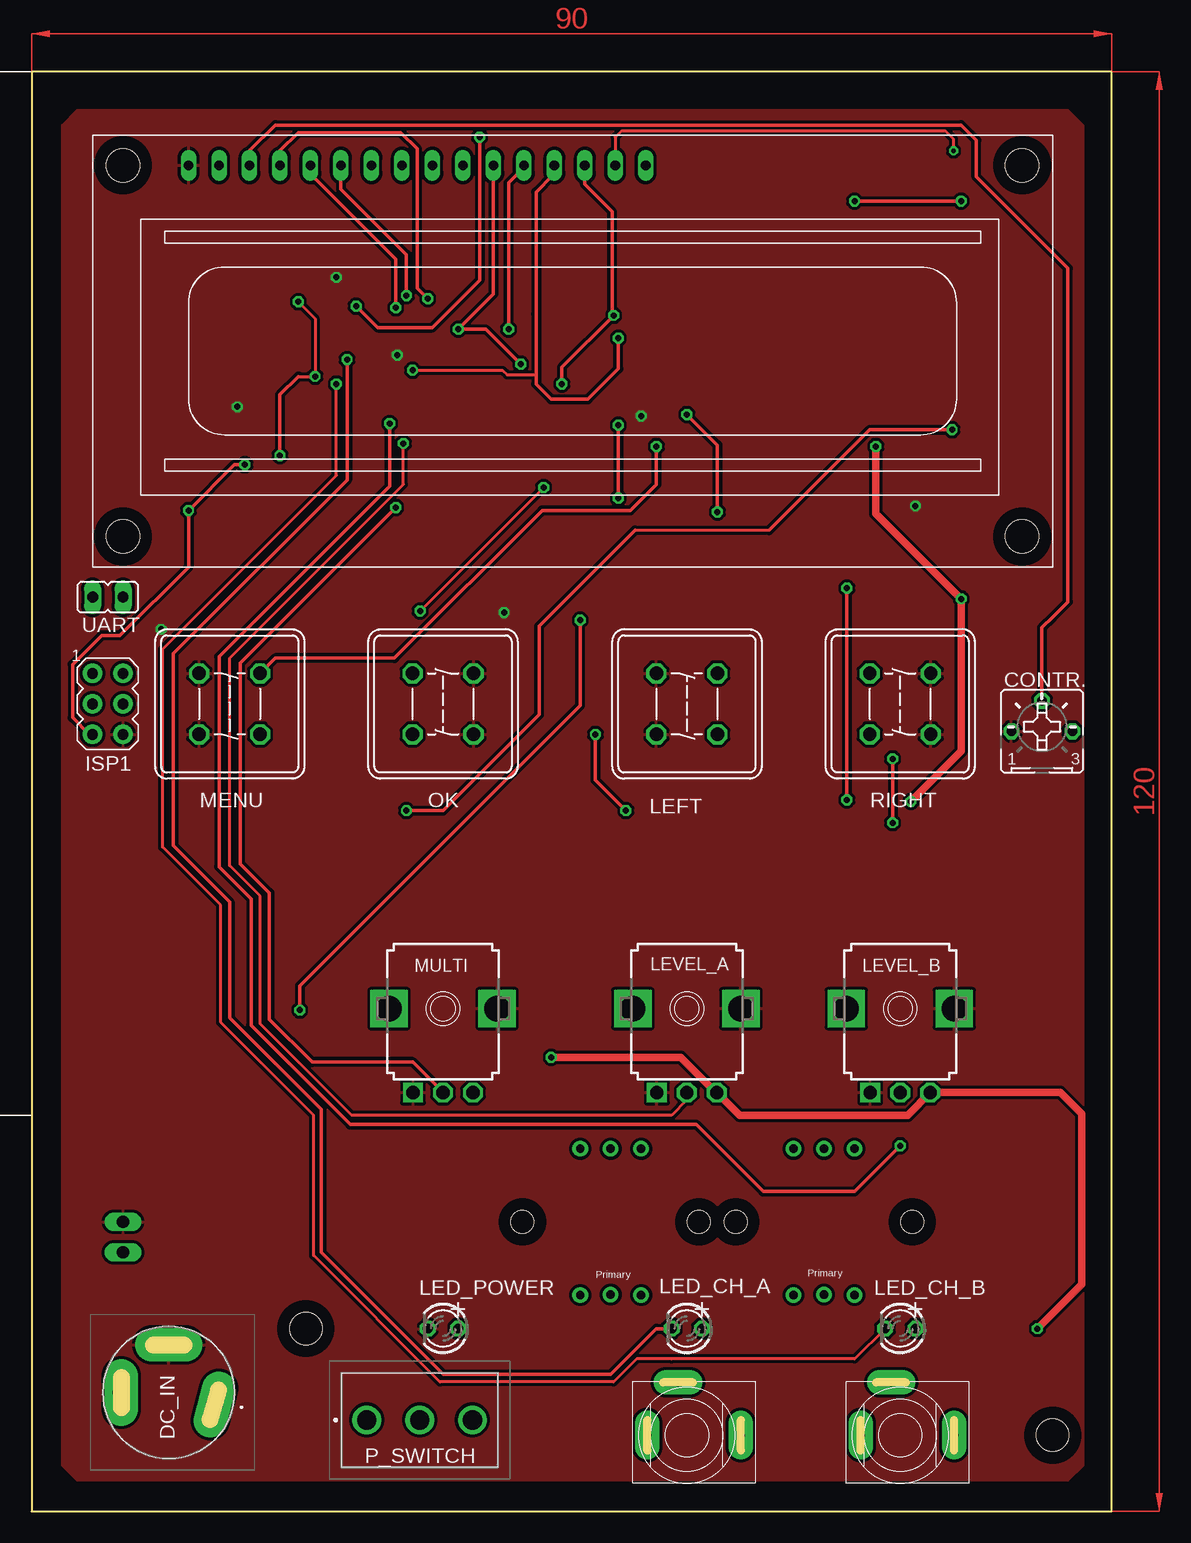
[diagram p5: board, top side]
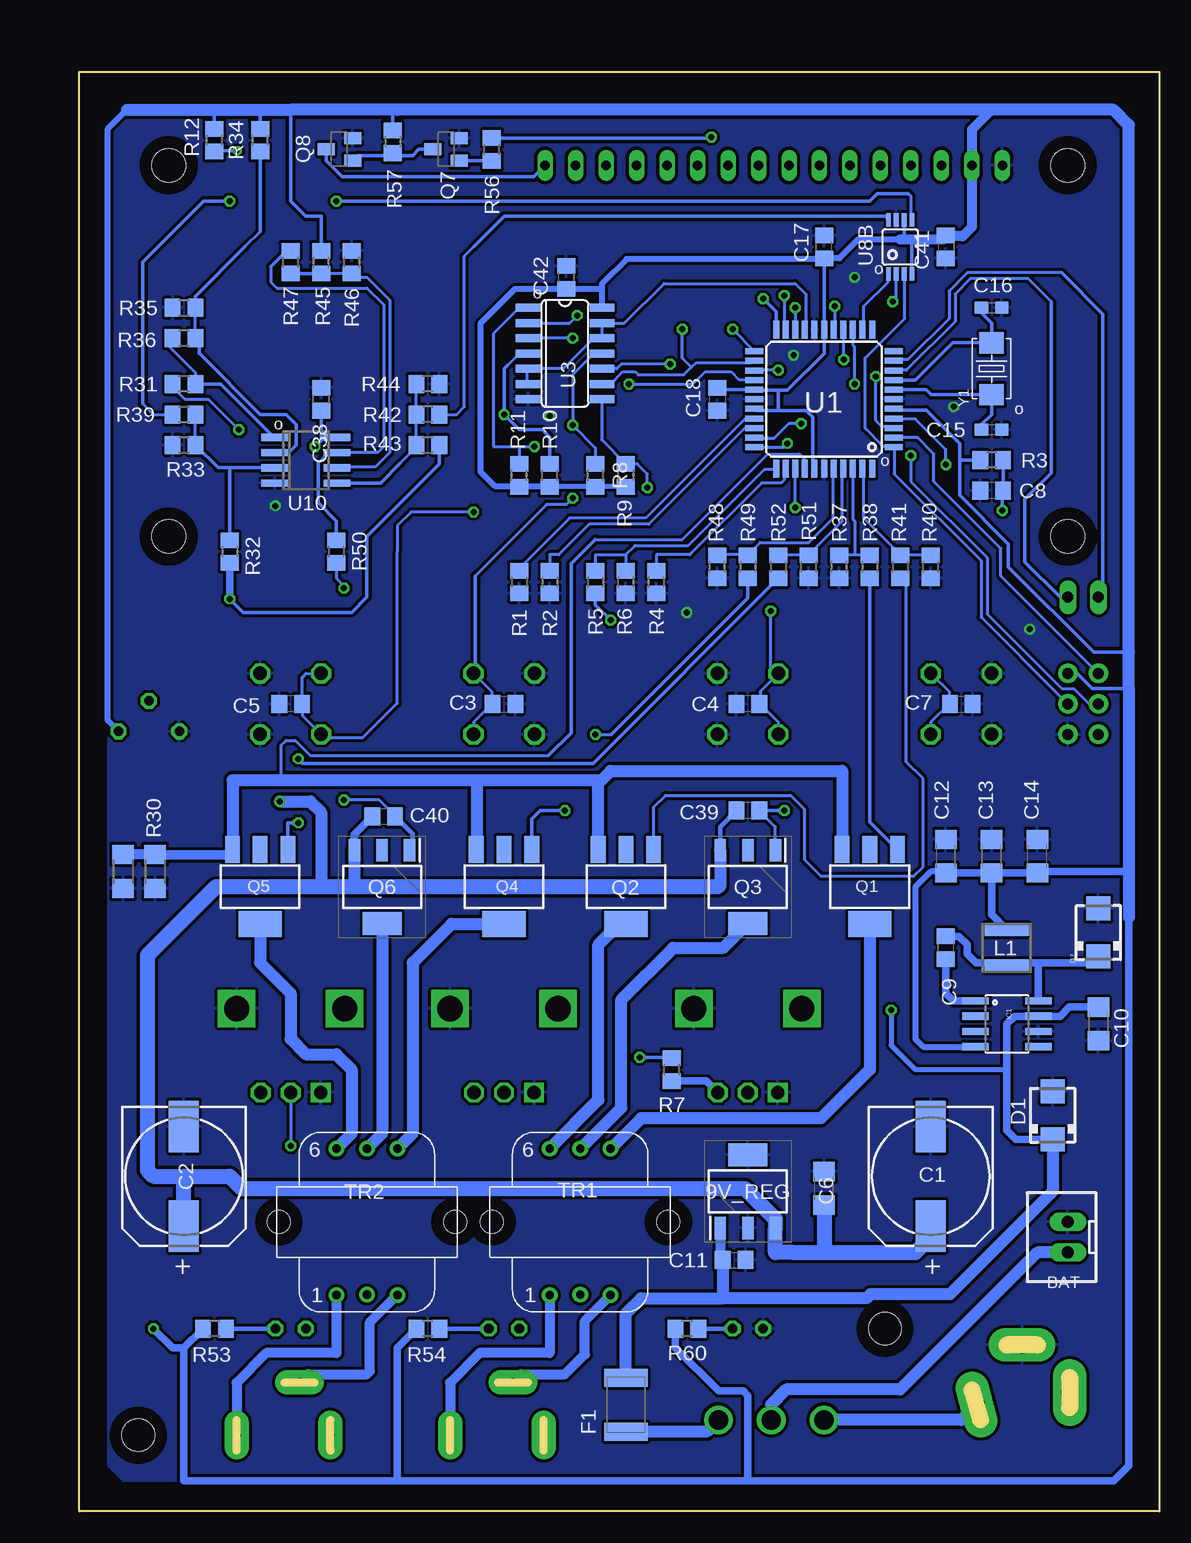
[diagram p6: board, bottom side, seen from below]

Size 90 x 120 mm. Coordinates in mm from the lower left corner, seen from the top.
Outline: 0,0 90,0 90,120 0,120 0,0
Copper layers (1*16): Top 0.035mm / dielectric 1.5mm / Bottom 0.035mm
Design rules "default": minimum track width 6mil, minimum drill 0.35mm, track to track 6mil, track to pad 6mil, pad to pad 6mil, via to via 6mil, smd to smd 6mil, copper to edge 40mil, drill to drill 6mil, minimum pad ring 10mil, minimum via ring 8mil, stop-mask expansion 4mil, vias tented up to drill 0mil, thermal gap 10mil
Holes 2.7 mm at 85.09,6.35 22.86,15.24

### Footprints (pad centres in the part's own frame; a part is rotated, then mirrored left to right if it is on the bottom)
SOT230P700X180-4N = smd 1.9 x 0.95: 1 -3.05,2.3; 2 -3.05,0; 3 -3.05,-2.3 | smd 1.9 x 3.25: 4 3.05,0
JST-XH-02-PACKAGE-LONG-PAD = drill 1.016 long: 1 -1.27,0; 2 1.27,0
150CLZ-1010 = smd 4.3 x 2.5: + 4.15,0; - -4.15,0
C0805 = smd 1.3 x 1.5: 1 -0.95,0; 2 0.95,0
C1206 = smd 1.6 x 1.8: 1 -1.4,0; 2 1.4,0
C0603 = smd 1.1 x 1: 1 -0.85,0; 2 0.85,0
PJ-301C = drill 0.65 pad 2.032 long: 1 4.4,0.75; 2 0,3.3; 3 0,-4.5
B25P = drill 0.813 octagon: A -2.54,0; E 2.54,0; S 0,2.54
SMA = smd 2 x 2: A 2,0; C -2,0
PC721A = drill 1.4 pad 2.8 long: 1 0,0; 2 -7.77,1.02; 3 -3.81,4.98
CT/CN1812 = smd 1.5 x 3.6: 1 -2.25,0; 2 2.25,0
SO08 = smd 0.61 x 2.21: 1 -1.905,-2.616; 2 -0.635,-2.616; 3 0.635,-2.616; 4 1.905,-2.616; 5 1.905,2.616; 6 0.635,2.616; 7 -0.635,2.616; 8 -1.905,2.616
AVRISP = drill 0.9 pad 1.626: 1 -1.27,2.54; 2 1.27,2.54; 3 -1.27,0; 4 1.27,0; 5 -1.27,-2.54; 6 1.27,-2.54
SMNR4030-151MT = smd 3.7 x 1.1: 1 0,1.5; 2 0,-1.5
LCD1602 = drill 0.8 long: 1 8,33.46; 2 10.54,33.46; 3 13.08,33.46; 4 15.62,33.46; 5 18.16,33.46; 6 20.7,33.46; 7 23.24,33.46; 8 25.78,33.46; 9 28.32,33.46; 10 30.86,33.46; 11 33.4,33.46; 12 35.94,33.46; 13 38.48,33.46; 14 41.02,33.46; 15 43.56,33.46; 16 46.1,33.46 | hole 2.8: 2.54,2.54; 2.54,33.46; 77.46,33.46; 77.46,2.54
LED3MM = drill 0.813 octagon: A -1.27,0; K 1.27,0
DTE6K = drill 1.118 octagon: 1 -2.54,2.54; 2 2.54,2.54; 3 2.54,-2.54; 4 -2.54,-2.54
9MM_SNAP-IN_POT = drill 1.1 square: 1 -2.5,-7 | drill 1.1 octagon: 2 0,-7; 3 2.5,-7 | drill 2.1 square: CHASSIS1 -4.5,0; CHASSIS2 4.5,0
8SS1012Z = drill 1.6 pad 2.4: 1 0,0; 2 0,-4.4; 3 0,-8.8
SOT223 = smd 1.219 x 2.235: 1 -2.311,-3.099; 2 0,-3.099; 3 2.311,-3.099 | smd 3.6 x 2.2: 4 0,3.099
SOT23-BEC = smd 1 x 1.4: B -0.95,-1.1; C 0,1.1; E 0.95,-1.1
R0805 = smd 1.3 x 1.5: 1 -0.95,0; 2 0.95,0
R1206 = smd 1.6 x 1.803: 1 -1.422,0; 2 1.422,0
42TL = drill 0.7 pad 1.3: 1 -2.54,-6.096; 2 0,-6.068; 3 2.54,-6.096; 4 2.54,6.096; 5 0,6.096; 6 -2.54,6.096 | hole 1.9: -7.353,0; 7.353,0
TQFP44 = smd 1.5 x 0.5: 1 -5.8,4; 2 -5.8,3.2; 3 -5.8,2.4; 4 -5.8,1.6; 5 -5.8,0.8; 6 -5.8,0; 7 -5.8,-0.8; 8 -5.8,-1.6; 9 -5.8,-2.4; 10 -5.8,-3.2; 11 -5.8,-4; 23 5.8,-4; 24 5.8,-3.2; 25 5.8,-2.4; 26 5.8,-1.6; 27 5.8,-0.8; 28 5.8,0; 29 5.8,0.8; 30 5.8,1.6; 31 5.8,2.4; 32 5.8,3.2; 33 5.8,4 | smd 0.5 x 1.5: 12 -4,-5.8; 13 -3.2,-5.8; 14 -2.4,-5.8; 15 -1.6,-5.8; 16 -0.8,-5.8; 17 0,-5.8; 18 0.8,-5.8; 19 1.6,-5.8; 20 2.4,-5.8; 21 3.2,-5.8; 22 4,-5.8; 34 4,5.8; 35 3.2,5.8; 36 2.4,5.8; 37 1.6,5.8; 38 0.8,5.8; 39 0,5.8; 40 -0.8,5.8; 41 -1.6,5.8; 42 -2.4,5.8; 43 -3.2,5.8; 44 -4,5.8
SO14 = smd 0.66 x 2.032: 1 -3.81,-3.073; 2 -2.54,-3.073; 3 -1.27,-3.073; 4 0,-3.073; 5 1.27,-3.073; 6 2.54,-3.073; 7 3.81,-3.073; 8 3.81,3.073; 9 2.54,3.073; 10 1.27,3.073; 11 0,3.073; 12 -1.27,3.073; 13 -2.54,3.073; 14 -3.81,3.073
MSOP8 = smd 0.4 x 1.1: 1 -0.975,-2.25; 2 -0.325,-2.25; 3 0.325,-2.25; 4 0.975,-2.25; 5 0.975,2.25; 6 0.325,2.25; 7 -0.325,2.25; 8 -0.975,2.25
SO08' = smd 0.6 x 2.2: 1 -1.905,-2.6; 2 -0.635,-2.6; 3 0.635,-2.6; 4 1.905,-2.6; 5 1.905,2.6; 6 0.635,2.6; 7 -0.635,2.6; 8 -1.905,2.6
JP1 = drill 0.914 long: 1 0,-1.27; 2 0,1.27
X2-SMD-5.0X3.2X1.3MM = smd 1.778 x 2.032: 1 -2.159,0; 2 2.159,0

### Placement (x,y rotation side)
9V_REG  34.29,26.67 90 bottom
BAT  7.62,22.86 90 bottom
C1  19.05,27.94 270 bottom
C2  81.28,27.94 270 bottom
C3  54.61,67.31 0 bottom
C4  34.29,67.31 180 bottom
C5  72.39,67.31 180 bottom
C6  27.94,26.92 90 bottom
C7  16.51,67.31 0 bottom
C8  13.97,85.09 180 bottom
C9  17.78,46.99 90 bottom
C10  5.08,40.64 270 bottom
C11  35.43,20.95 0 bottom
C12  17.78,54.61 90 bottom
C13  13.97,54.61 90 bottom
C14  10.16,54.61 90 bottom
C15  13.97,90.17 0 bottom
C16  13.97,100.33 0 bottom
C17  27.94,105.41 90 bottom
C18  36.83,92.71 270 bottom
C38  69.85,92.71 90 bottom
C39  34.29,58.42 180 bottom
C40  64.64,57.91 180 bottom
C41  17.78,105.41 270 bottom
C42  49.4,102.87 90 bottom
CHAN_A  54.61,6.35 90 top
CHAN_B  72.39,6.35 90 top
CONTR.  84.2,65.02 0 top
D1  8.89,33.02 90 bottom
D2  5.08,48.26 90 bottom
DC_IN  15.24,8.89 0 top
F1  44.45,8.89 90 bottom
IC1  12.7,40.64 270 bottom
ISP1  6.35,67.31 0 top
L1  12.7,46.99 180 bottom
LCD1  5.08,78.74 0 top
LED_CH_A  54.61,15.24 180 top
LED_CH_B  72.39,15.24 180 top
LED_POWER  34.29,15.24 180 top
LEFT  54.61,67.31 270 top
LEVEL_A  54.61,41.91 0 top
LEVEL_B  72.39,41.91 0 top
MENU  16.51,67.31 270 top
MULTI  34.29,41.91 0 top
OK  34.29,67.31 90 top
P_SWITCH  27.94,7.62 90 top
Q1  24.13,52.07 180 bottom
Q2  44.45,52.07 180 bottom
Q3  34.29,52.07 270 bottom
Q4  54.61,52.07 180 bottom
Q5  74.93,52.07 180 bottom
Q6  64.77,52.07 270 bottom
Q7  59.44,113.54 90 bottom
Q8  68.33,113.54 90 bottom
R1  53.34,77.47 270 bottom
R2  50.8,77.47 270 bottom
R3  13.97,87.63 180 bottom
R4  41.91,77.47 90 bottom
R5  46.99,77.47 270 bottom
R6  44.45,77.47 90 bottom
R7  40.64,36.83 90 bottom
R8  46.99,86.36 90 bottom
R9  44.45,86.36 90 bottom
R10  50.8,86.36 90 bottom
R11  53.34,86.36 90 bottom
R12  78.74,114.3 90 bottom
R30  83.69,53.34 90 bottom
R30_2  86.36,53.34 90 bottom
R31  81.28,91.44 0 bottom
R32  77.47,80.01 270 bottom
R33  81.28,88.9 0 bottom
R34  74.93,114.3 90 bottom
R35  81.28,100.33 0 bottom
R36  81.28,97.79 180 bottom
R37  26.67,78.74 90 bottom
R38  24.13,78.74 270 bottom
R39  81.28,93.98 180 bottom
R40  19.05,78.74 90 bottom
R41  21.59,78.74 270 bottom
R42  60.96,91.44 180 bottom
R43  60.96,88.9 0 bottom
R44  60.96,93.98 180 bottom
R45  69.85,104.14 90 bottom
R46  67.31,104.14 270 bottom
R47  72.39,104.14 90 bottom
R48  36.83,78.74 90 bottom
R49  34.29,78.74 270 bottom
R50  68.58,80.01 270 bottom
R51  29.21,78.74 90 bottom
R52  31.75,78.74 270 bottom
R53  78.74,15.24 180 bottom
R54  60.96,15.24 180 bottom
R56  55.63,113.54 90 bottom
R57  63.88,114.17 270 bottom
R60  39.37,15.24 180 bottom
RIGHT  72.39,67.31 90 top
TR1  48.26,24.13 0 bottom
TR2  66.04,24.13 0 bottom
U1  27.94,92.71 180 bottom
U3  49.53,96.52 270 bottom
U8B  21.59,105.41 0 bottom
U10  LM358D  [SO08']  71.12,87.63 270 bottom
UART  6.35,76.2 270 top
Y1  13.97,95.25 90 bottom

### Tracks (layer width: path | path; a pad name or v marks a point on that pad's centre or on a via)
!CS
  Bottom 0.254: U8B.1 22.61,103.12 22.61,102.49 24.64,100.46 24.64,98.55 U1.13
+5V  (via drill 0.5)
  Top 0.305: 57.02,34.92 LEVEL_A.3
  Top 0.61: v43.31,37.85 54.1,37.85 57.02,34.92 | LEVEL_A.3 59,33.02 73,33.02 LEVEL_B.3 85.74,34.91 87.5,33.15 87.5,18.92 v83.82,15.24
  Bottom 0.305: C18.1 36.68,93.51 U1.27 33.66,93.47 31.75,93.47 | C17.1 U1.17 27.94,96.52 30.99,93.47 31.75,93.47 | U1.38 28.83,87 28.88,87.05 28.88,91.21 29.44,91.77 31.75,91.77 | U1.29 33.66,91.82 33.6,91.77 31.75,91.77 | 53.34,85.47 R11.1 53.21,85.34 | v43.31,37.85 40.64,37.85 R7.2 | U1.5 22.1,91.82 19.43,91.82 16.64,89.03 16.64,87.63 | R45.2 69.85,107.95 71.12,107.95 72.39,109.22 72.39,116.84 | ISP1.2 6.86,69.85 5.59,68.58 2.54,68.58 | 16.64,87.63 16.64,84.71 12.57,80.64 12.57,78.74 5.46,71.63 2.54,71.63 | R34.2 74.93,116.84 | U8B.6 21.27,106.05 | R57.1 63.88,116.46 63.5,116.84 | R3.2 16.64,87.63 | 31.75,93.47 31.75,91.77 | 17.97,106.05 17.72,106.3 | 20.7,106.05 20.61,105.96 U8B.4 | R12.2 78.74,116.84 | C14.1 10.03,53.34
  Bottom 0.406: R9.1 R8.1 R10.1
  Bottom 0.5: C12.1 17.91,53.34 19.05,53.34 20.32,52.07 20.32,39.37 19.68,38.73 IC1.4
  Bottom 0.508: CONTR..E 87.63,65.91 87.63,115.25 86.04,116.84 | 53.34,85.47 55.37,85.47 56.58,86.67 56.58,99 53.66,101.92 C42.1 46.46,101.92 | 21.27,106.05 21.59,106.05 25.09,106.05 26.67,104.46 C17.1 28.01,104.39 44.4,104.39 46.46,102.34 46.46,101.92 | R10.1 53.15,85.41 53.21,85.34 | 46.46,101.92 U3.14 | 17.72,106.3 C41.1
  Bottom 0.61: v83.82,15.24 82.23,13.65 81.28,13.65 | 2.54,49.53 2.54,38.1 | C12.1 C13.1 | C13.1 C14.1 | L1.2 13.97,49.76 C13.1 | 10.03,53.34 2.54,53.34
  Bottom 0.635: R53.2 81.28,13.65 81.28,2.54 63.5,2.54 | R54.2 63.5,13.65 63.5,2.54 | R60.2 40.32,13.65 36.7,10.03 34.67,10.03 34.29,9.65 34.29,2.54 | 34.29,2.54 63.5,2.54 | 34.29,2.54 3.81,2.54 2.54,3.81 2.54,38.1
  Bottom 0.813: 13.97,116.84 15.62,115.19 LCD1.2 15.62,107.06 16.38,106.3 17.72,106.3 | 21.59,106.05 20.7,106.05 17.97,106.05
  Bottom 1.016: 86.04,116.84 78.74,116.84 74.93,116.84 72.39,116.84 63.5,116.84 13.97,116.84 3.81,116.84 2.54,115.57 2.54,71.63 2.54,68.58 2.54,53.34 2.54,49.53
+9V  (via drill 0.5)
  Top 0.61: v70.36,88.77 70.36,83.19 v77.47,76.07 77.47,63.37 v73.28,59.18
  Bottom 0.305: U10.8 68.58,89.41 69.72,89.41 v70.36,88.77 69.85,89.28 C38.1 | C1.+ 18.8,23.62 18.8,23.24 19.05,22.86 | R43.2 60.01,87.31 66.04,81.28 66.04,76.2 67.31,74.93 76.33,74.93 v77.47,76.07
  Bottom 0.381: Q3.3 36.59,57.07 C39.2
  Bottom 0.508: 67.07,52.21 66.93,52.07
  Bottom 0.61: Q6.3 67.07,56.44 C40.2 | R32.2 v77.47,76.07
  Bottom 1.016: Q3.3 36.59,52.07 | 36.59,52.07 36.83,52.07 36.59,52.07 | Q6.3 67.07,52.21 | v73.28,59.18 70.74,59.18 69.85,58.29 69.85,52.07 | 27.94,21.59 30.48,21.59
  Bottom 1.27: 36.83,52.07 66.93,52.07 69.85,52.07 78.61,52.07 84.33,46.35 84.33,28.45 83.82,27.94 81.28,27.94 | C6.1 27.94,21.59 | 19.05,22.86 20.32,21.59 30.48,21.59 31.99,21.59 9V_REG.3 31.99,24.37 34.54,26.92 76.45,26.92 77.47,27.94 81.28,27.94 | C2.+ 81.28,27.94
+12V  (via drill 0.5)
  Top 0.305: v45.72,74.3 45.72,67.18 22.35,43.81 v22.35,41.78
  Bottom 0.305: R5.2 46.99,75.56 v45.72,74.3
  Bottom 0.406: v22.35,41.78 22.35,38.86 20.32,36.83 12.7,36.83
  Bottom 0.61: C10.1 7.49,42.04 8.26,41.27 IC1.7 12.06,41.27 12.7,40.64 12.7,36.83 12.7,31.75 11.97,31.02 D1.C
  Bottom 0.813: 9V_REG.1 36.59,21.16 C11.1
  Bottom 1.016: D1.C 8.89,26.67 17.45,18.11 24.05,18.11 24.38,17.78 36.32,17.78 | 36.32,17.78 43.18,17.78 44.45,16.51 F1.2 | C11.1 36.38,17.84 36.32,17.78
GND  (via drill 0.5)
  other vias: 10.79,73.53 39.37,74.93 30.48,96.39 50.8,91.31 17.14,92.08 25.4,102.87 73.66,83.82
  pour Top: 3.81,116.84 86.36,116.84 87.63,115.57 87.63,3.81 86.36,2.54 3.81,2.54 2.54,3.81 2.54,115.57
  pour Bottom: 2.54,115.57 3.81,116.84 86.36,116.84 87.63,115.57 87.63,3.81 86.36,2.54 3.81,2.54 2.54,3.81
N$1
  Bottom 0.635: MULTI.3 37.76,35.88 R7.1
N$2
  Bottom 0.254: 44.45,79.76 46.99,79.76 R5.1 | 44.45,79.76 R6.2 44.45,79.76 | 44.45,79.76 43.69,80.52 39.24,80.52 32.89,86.87 32,86.87 U1.34
N$3
  Bottom 0.254: R4.2 41.91,79.76 39.12,79.76 33.15,85.72 31.5,85.72 31.24,85.98 31.24,86.87 U1.35
N$4  (via drill 0.5)
  Top 0.254: v32.38,75.06 v42.67,85.34
  Bottom 0.254: 33.27,67.31 33.27,68.33 OK.2 31.88,69.85 32.38,70.36 v32.38,75.06 | 33.27,67.31 C4.1 33.27,67.31 | OK.1 31.75,65.79 33.27,67.31 | U3.8 46.48,92.69 46.48,89.34 R9.2 43.49,87.31 42.67,86.49 v42.67,85.34
N$5  (via drill 0.5)
  Top 0.305: v48.9,84.45 48.9,89.41 v48.9,90.55
  Bottom 0.254: 55.63,67.31 55.63,68.33 LEFT.1 57.02,69.85 | 55.63,67.31 C3.1 55.63,67.31 | LEFT.2 57.15,65.79 55.63,67.31 | U3.11 46.48,96.52 47.12,96.52 48.9,94.74 v48.9,90.55 46.99,88.65 R8.2 | 57.02,77.98 51.05,83.95 49.4,83.95 v48.9,84.45
  Bottom 0.305: 57.02,77.98 57.02,69.85
N$6
  Bottom 1.016: TR1.5 44.83,33.66 44.83,42.67 40.51,46.99 36.32,46.99 Q3.4
N$7  (via drill 0.5)
  Top 0.305: v54.61,91.44 57.15,88.9 v57.15,83.31
  Bottom 0.254: 54.36,95.5 53.34,96.52 52.7,96.52 U3.4 | 50.8,87.25 R10.2 | v57.15,83.31 62.23,83.31 62.36,83.31 63.5,82.17 63.5,80.01 63.5,67.38 66.36,64.52 69.6,64.52 RIGHT.1 71.37,66.29 71.37,67.31 C5.1 71.44,69.53 71.12,69.85 RIGHT.2
  Bottom 0.305: 54.36,95.5 54.61,95.25 v54.61,91.44 53.34,90.17 51.44,90.17 50.8,89.53 50.8,87.25
N$8
  Bottom 1.016: Q6.4 64.77,31.5 TR2.5
N$9
  Bottom 1.016: BAT.1 10.16,21.59 21.59,10.16 31.07,10.16 32.34,8.89 P_SWITCH.2
N$10
  Bottom 1.016: P_SWITCH.3 37.72,6.64 F1.1
N$11
  Bottom 0.813: CHAN_A.1 53.18,11.43 49.53,11.43 47.88,13.08 47.88,15.88 TR1.3
N$12
  Bottom 0.813: TR1.1 50.8,13.21 56.64,13.21 59.11,10.74 CHAN_A.3
N$13
  Bottom 0.813: CHAN_B.1 70.96,11.43 66.04,11.43 65.79,11.68 65.79,15.75 TR2.3
N$14
  Bottom 1.016: DC_IN.1 16.51,7.62 P_SWITCH.1
N$15
  Bottom 0.813: TR2.1 68.58,13.21 74.42,13.21 76.89,10.74 CHAN_B.3
N$16
  Bottom 0.254: R1.1 53.34,78.61 49.15,82.8 42.8,82.8 34.54,91.06 33.78,91.06 U1.30
N$17
  Bottom 0.305: U1.8 20.32,94.31 17.22,97.41 Y1.2 13.97,99.06 14.82,99.91 C16.1
N$18
  Bottom 0.305: Q1.1 24.13,57.48 R38.2
N$19
  Bottom 0.254: Q2.1 42.14,58.7 41.15,59.69 30.73,59.69 29.59,58.55 29.59,54.36 28.19,52.96 20.45,52.96 19.68,53.72 19.68,61.09 21.08,62.48 21.08,77.72 21.08,77.79 R41.2
N$20
  Bottom 0.254: R2.1 50.8,79.76 50.04,79.76 47.5,82.3 42.55,82.3 34.54,90.3 33.78,90.3 U1.31
N$21  (via drill 0.5)
  Top 0.254: 50.29,81.79 61.47,81.79
  Top 0.305: v76.71,90.17 69.85,90.17 61.47,81.79 | 50.29,81.79 42.29,73.79 42.29,66.42 34.29,58.42 v31.24,58.42
  Bottom 0.254: Q3.1 31.99,57.07 C39.1 | R39.2 82.23,93.73 81.21,92.7 79.24,92.7 v76.71,90.17
  Bottom 0.305: v31.24,58.42 C39.1
N$22
  Bottom 0.254: R33.2 80.39,88.9 80.39,91.44 R31.2
  Bottom 0.305: R32.1 77.47,87 74.93,87 | U10.3 74.93,87 | R33.2 78.42,87 74.93,87
N$23
  Bottom 0.381: R53.1 LED_CH_B.A
N$24  (via drill 0.5)
  Top 0.305: v46.99,64.77 46.99,60.96 v49.53,58.42
  Bottom 0.254: v46.99,64.77 45.66,64.77
  Bottom 0.305: Q4.1 52.3,57.71 51.59,58.42 v49.53,58.42 | R49.2 34.29,76.14 45.66,64.77
N$25  (via drill 0.5)
  Top 0.305: v71.75,62.74 v71.75,57.4
  Bottom 0.305: R52.2 47.18,62.36 71.37,62.36 v71.75,62.74 | v71.75,57.4 72.62,57.4 Q5.1
N$26
  Bottom 0.254: 8.13,103.25 16,103.25 17.53,101.73 17.53,99.44 20.95,96.01 22.1,96.01 U1.10
  Bottom 0.305: 8.13,103.25 4.7,99.82 4.7,76.58 UART.1
N$27  (via drill 0.5)
  Top 0.305: v67.94,76.96 v67.94,59.31
  Bottom 0.254: v67.94,59.31 65.02,59.31 63.75,58.04 C40.1 | Q6.1 62.36,55.24 62.36,55.75 62.23,55.88 | R50.2 68.58,77.79 67.94,77.16 v67.94,76.96
  Bottom 0.381: C40.1 62.23,56.45 62.23,55.88
N$28
  Bottom 0.254: 63.25,87.38 61.91,88.71 R43.1 R42.2 R44.2
  Bottom 0.305: 63.25,87.38 64.9,85.72 U10.5
N$29
  Bottom 0.381: R54.1 LED_CH_A.A
N$30
  Top 0.305: LCD1.3 18.16,113.41 20.32,115.57 77.47,115.57 78.74,114.3 78.74,111.25 86.36,103.63 86.36,75.82 85.09,74.55 84.2,73.66 CONTR..S
N$31
  Bottom 0.254: 9.02,100.84 10.92,102.74 15.75,102.74 17.02,101.47 17.02,99.19 21.08,95.12 22.1,95.12 U1.9
  Bottom 0.305: 9.02,100.84 9.02,86.56 11.2,84.38 11.2,79.15 8.26,76.2 UART.2
N$32
  Bottom 0.305: U1.7 19.43,93.51 19.01,93.09 Y1.1 13.97,91.44 14.82,90.59 C15.1
N$33
  Bottom 0.61: C9.1 17.78,43.18 17.14,42.55 IC1.1
N$34
  Bottom 1.016: Q1.4 24.13,36.83 28.19,32.77 43.18,32.77 TR1.4
N$35
  Bottom 0.5: 12.47,45.72 L1.1 12.93,45.72 | 10.08,45.64 10.16,45.72 | 5.27,45.72 D2.C
  Bottom 0.61: 12.47,45.72 10.16,45.72 5.27,45.72 | IC1.8 10.08,45.64 | 12.93,45.72 15.24,45.72 16,46.48 16,47.24 16.7,47.94 C9.2
N$36
  Bottom 1.016: TR2.4 62.23,31.5 62.23,45.72 58.98,48.97 Q4.4
N$38
  Bottom 1.016: Q5.4 74.93,45.72 72.39,43.18 72.39,39.37 71.12,38.1 68.58,38.1 67.31,36.83 67.31,31.5 TR2.6
N$39
  Bottom 0.381: 45.01,48.97 Q2.4
  Bottom 1.016: TR1.6 46.74,34.29 46.74,47.24 45.01,48.97
N$40
  Bottom 0.254: 74.93,106.68 76.2,105.41 | R36.1 R35.2
  Bottom 0.305: U10.2 72.54,88.27 71.91,88.9 71.91,90.58 72.77,91.44 74.9,91.44 80.01,96.55 80.01,96.52 80.01,97.47 R36.1 | R34.1 74.93,106.68 | R35.2 80.33,101.28 76.2,105.41
N$41
  Bottom 0.254: 68.45,87 U10.6 | R45.1 R46.2 66.99,102.87 66.04,102.87 64.77,101.6 64.14,100.97 64.14,88.27 65.34,87.06 68.39,87.06
  Bottom 0.305: 68.39,87.06 68.45,87 | R45.1 R47.1
N$42  (via drill 0.5)
  Top 0.305: v68.58,109.22 v77.47,109.22
  Bottom 0.254: 20.91,109.86 20.68,109.64 20.68,107.73 U8B.5 | 84.71,92.33 83.82,91.44 R31.1
  Bottom 0.305: 84.71,92.33 84.71,104.14 79.63,109.22 v77.47,109.22 | 20.91,109.86 23.49,109.86 24.13,109.22 v68.58,109.22
N$47  (via drill 0.35)
  Top 0.254: LCD1.15 48.64,114.55 49.12,115.04 76.2,115.04 76.83,114.4 v76.83,113.41
  Bottom 0.305: v76.83,113.41 78.68,113.41 R12.1
N$80  (via drill 0.5)
  Top 0.305: MENU.1 20.32,71.12 30.23,71.12 42.55,83.44 49.91,83.44 52.07,85.6 v52.07,88.77
  Bottom 0.254: 17.53,67.31 17.53,68.33 MENU.1 | 17.53,67.31 C7.1 17.53,67.31 | MENU.2 19.05,65.79 17.53,67.31 | 53.34,88.77 53.34,88.39 53.34,87.38 R11.2 | U3.1 52.7,100.33 53.34,100.33 55.5,98.17 55.5,88.77 53.34,88.77 | 53.34,88.77 v52.07,88.77
N$81
  Bottom 0.381: LED_POWER.A R60.1
N$82
  Bottom 0.305: Q7.B R56.1
N$83
  Bottom 0.254: Q7.C 60.58,113.54
  Bottom 0.305: 60.58,113.54 61.72,113.54 62.23,113.03 63.5,113.03 | 63.5,113.03 63.69,113.03 R57.2 | Q8.B 66.78,113.03 63.5,113.03
N$84
  Bottom 0.305: Q8.C 69.43,112.61 68.07,111.25 52.13,111.25 LCD1.16
N$85
  Bottom 0.254: 22.86,107.95 U8B.8 | 57.15,105.41 57.95,104.61 57.91,104.58 57.91,92.08 58.55,91.44 R42.1
  Bottom 0.305: 22.86,107.95 54.61,107.95 57.15,105.41
PA0
  Bottom 0.254: 46.99,81.03 39.75,81.03 32.64,88.14 29.97,88.14 29.59,87.76 29.59,87 U1.37 | 50.93,62.99 70.74,62.99 72.01,64.26 72.77,64.26 73.15,63.88 73.15,60.96
  Bottom 0.305: 46.99,81.03 49.02,78.99 49.02,64.9 50.93,62.99
  Bottom 0.813: Q5.3 77.67,54.74 R30.2 R30_2.2
  Bottom 1.016: 56.9,60.96 73.15,60.96 77.22,60.96 77.22,55.19 Q5.3 | 46.99,60.96 46.76,60.73 Q2.3 | 56.9,60.96 46.99,60.96 | 56.9,60.96 56.9,55.19 Q4.3 | Q1.3 26.44,61.72 45.72,61.72 46.48,60.96 46.99,60.96
PA1  (via drill 0.5)
  Top 0.305: v30.35,83.69 17.4,70.74 17.4,53.98 19.81,51.56 19.81,41.02 23.38,37.45 31.75,37.45 MULTI.2
  Bottom 0.254: v30.35,83.69 30.35,86.74 U1.36
PA4  (via drill 0.5)
  Top 0.254: LEVEL_A.2 54.61,34.29 53.34,33.02 26.67,33.02 19.05,40.64 19.05,51.3 16.51,53.84 16.51,71.12 30.99,85.6 v30.99,89.03
  Bottom 0.254: U1.33 31.3,88.71 v30.99,89.03
PA5  (via drill 0.5)
  Top 0.305: v29.84,90.68 29.84,85.47 15.62,71.25 15.62,53.72 18.29,51.05 18.29,40.51 26.54,32.26 55.37,32.26 60.96,26.67 68.58,26.67 v72.39,30.48
  Bottom 0.254: v29.84,90.68 30.86,90.68 32.13,89.41 33.53,89.41 U1.32 | LEVEL_B.2 v72.39,30.48
PB0
  Bottom 0.254: 34.29,79.76 33.27,80.77 29.21,80.77 27.18,82.8 27.18,86.87 U1.40 | 34.29,79.76 R49.1 34.29,79.76 | 34.29,79.76 36.83,79.76 R48.2
PB1
  Bottom 0.254: 29.21,79.76 31.75,79.76 R52.1 | 29.21,79.76 R51.2 29.21,79.76 | 29.21,79.76 26.42,82.55 26.42,86.87 U1.41
PB2
  Bottom 0.254: 25.4,79.76 25.53,79.76 26.67,79.76 R37.2 | 25.4,79.76 24.13,79.76 R38.1 | U1.42 25.54,82.69 25.4,82.55 25.4,79.76
PB3
  Bottom 0.254: 21.59,79.76 19.05,79.76 R40.2 | 21.59,79.76 R41.1 21.59,79.76 | 21.59,79.76 24.64,82.8 24.64,86.87 U1.43
PB5
  Bottom 0.254: U8B.3 21.21,103.12 21.21,99.44 24.51,96.14 24.51,90.3 22.99,88.77 22.23,88.77 U1.1 22.1,88.65 22.1,86.49 14.86,79.25 14.86,74.55 8.38,68.07 ISP1.4
PB6
  Bottom 0.254: U1.2 22.11,89.53 20.19,89.53 18.8,88.14 18.8,85.85 13.21,80.26 13.21,77.98 ISP1.1
PB7  (via drill 0.5)
  Top 0.254: 22.23,94.61 v23.62,94.61 23.62,99.44 v22.23,100.84
  Top 0.305: v20.7,88.01 20.7,93.09 22.23,94.61
  Bottom 0.254: v23.62,94.61 23.62,90.93 23.11,90.42 22.23,90.42 U1.3 | U8B.2 21.98,103.1 21.97,103.09 21.97,101.09 v22.23,100.84 | ISP1.3 5.84,67.31 7.11,68.58 8.13,68.58 14.35,74.8 14.35,79.5 20.7,85.85 v20.7,88.01
PC0
  Bottom 0.254: U3.6 52.7,93.98 52.7,95.25 U3.5 49.66,95.25 47.12,97.79 46.48,97.79 | U1.19 29.46,98.59 29.46,101.47 30.35,102.36 41.27,102.36 44.58,99.06 U3.13 46.48,99.06 46.48,97.79 | 46.48,97.79 U3.12
PC1  (via drill 0.5)
  Top 0.254: 23.24,112.14 LCD1.5
  Top 0.305: v30.35,100.33 30.35,104.39 23.24,111.51 23.24,112.14
  Bottom 0.254: v30.35,100.33 30.35,98.55 U1.20
PC2  (via drill 0.5)
  Top 0.254: 25.78,112.14 LCD1.6
  Top 0.305: v31.24,101.35 31.24,104.78 25.78,110.24 25.78,112.14
  Bottom 0.254: v31.24,101.35 31.24,98.55 U1.21
PC3  (via drill 0.5)
  Top 0.305: v33.02,101.09 32.13,101.98 32.13,113.59 30.79,114.94 22.23,114.94 20.7,113.41 LCD1.4
  Bottom 0.305: v33.02,101.09 31.94,100.01 U1.22
PC4  (via drill 0.5)
  Top 0.254: 38.48,109.22
  Top 0.305: 38.48,109.22 38.48,101.47 v35.56,98.55 37.85,98.55 v40.77,95.63 | LCD1.11 38.48,109.22
  Bottom 0.254: v35.56,98.55 33.78,96.77 U1.23 | v40.77,95.63 44.83,95.63 45.21,95.25 46.35,95.25 U3.10
PC5  (via drill 0.5)
  Top 0.254: 40.89,111.89 40.89,112.14 LCD1.12
  Top 0.305: 40.89,111.89 39.75,110.74 v39.75,98.55
  Bottom 0.254: 38.99,95.38 39.62,94.74 43.43,94.74 43.69,95 44.7,95 45.72,93.98 46.35,93.98 U3.9 | 38.99,95.38 38.61,95.76 33.99,95.76 U1.24 | v39.75,98.55 39.75,96.14 39.5,95.89 39.43,95.82 38.99,95.38
PC6  (via drill 0.5)
  Top 0.254: 43.43,111.38 43.43,112.14 LCD1.13 | v31.75,95.12 39.24,95.12 39.62,94.74 42.04,94.74
  Top 0.305: 43.43,111.38 42.04,109.98 42.04,99.82 42.04,94.74 42.04,93.98 43.31,92.71 46.35,92.71 48.9,95.25 v48.9,97.79
  Bottom 0.254: v48.9,97.79 U3.3 | v31.75,95.12 33.73,95.12 U1.25
PC7  (via drill 0.5)
  Top 0.254: 46.1,112.14 LCD1.14 | 48.39,99.69 v48.51,99.69
  Top 0.305: v48.51,99.69 44.2,95.38 v44.2,93.98 | 46.1,112.14 46.1,110.62 48.39,108.33 48.39,99.69
  Bottom 0.254: v44.2,93.98 38.86,93.98 37.85,95 35.69,95 35.05,94.36 33.78,94.36 U1.26 | v48.51,99.69 49.15,99.06 52.58,99.06 U3.2
PD5  (via drill 0.5)
  Top 0.254: LED_CH_B.K 68.58,12.7 53.34,12.7 50.42,12.7 48.51,10.79 34.04,10.79 23.5,21.34 23.5,33.02 15.75,40.77 15.75,50.55 10.92,55.37 10.92,71.88 25.4,86.36 v25.4,93.98
  Bottom 0.254: U1.14 25.54,97.23 25.4,97.09 v25.4,93.98
PD6  (via drill 0.5)
  Top 0.305: v26.29,96.01 26.29,85.98 11.81,71.5 11.81,55.5 16.51,50.8 16.51,41.15 24.13,33.53 24.13,21.59 34.29,11.43 48.26,11.43 52.07,15.24 LED_CH_A.K
  Bottom 0.254: v26.29,96.01 26.29,98.46 U1.15
PD7  (via drill 0.5)
  Top 0.305: v27.05,100.46 28.83,98.68 33.4,98.68 37.34,102.62 v37.34,114.55
  Bottom 0.254: v27.05,100.46 27.05,98.55 U1.16
  Bottom 0.305: v37.34,114.55 37.4,114.49 R56.2
PFET_A
  Bottom 0.254: 80.26,93.98 R39.1 80.33,94.94 82.55,97.16 82.55,97.47 R36.2 | 73.79,89.53 U10.1
  Bottom 0.305: 73.79,89.53 77.22,92.96 78.23,93.98 80.26,93.98
PFET_B
  Bottom 0.254: 70.1,87.38 70.04,87.44 69.22,88.27 68.58,88.27 U10.7 65.15,88.27 64.64,88.77 64.64,100.58 66.04,101.98 73.53,101.98 74.04,102.49 74.04,103.76 73.66,104.14
  Bottom 0.305: 70.1,87.38 70.1,85.34 70.1,84.07 68.58,82.55 R50.1 | 74.04,103.76 73.66,104.14 72.71,105.09 R47.2
RESET  (via drill 0.5)
  Top 0.254: 4.83,64.77 ISP1.5
  Top 0.305: 4.83,64.77 3.43,66.17 3.43,70.61 5.84,73.03 7.37,73.03 13.08,78.74 v13.08,83.44 16.89,87.25 v17.78,87.25
  Bottom 0.254: v17.78,87.25 17.78,88.52 20.32,91.06 22.1,91.06 U1.4
  Bottom 0.305: R3.1 C8.1 13.08,85.03 v13.08,83.44
(copper drawn outside any net)
  shapes: Top area x2

### Text on the board
tNames: Primary | Primary | + | + | +
bNames: o | o | o | o | o | + | +